# Altium project Air724UG_Reference Design_V1.0(PADS9.5).PrjPcb (part 1 of 3)
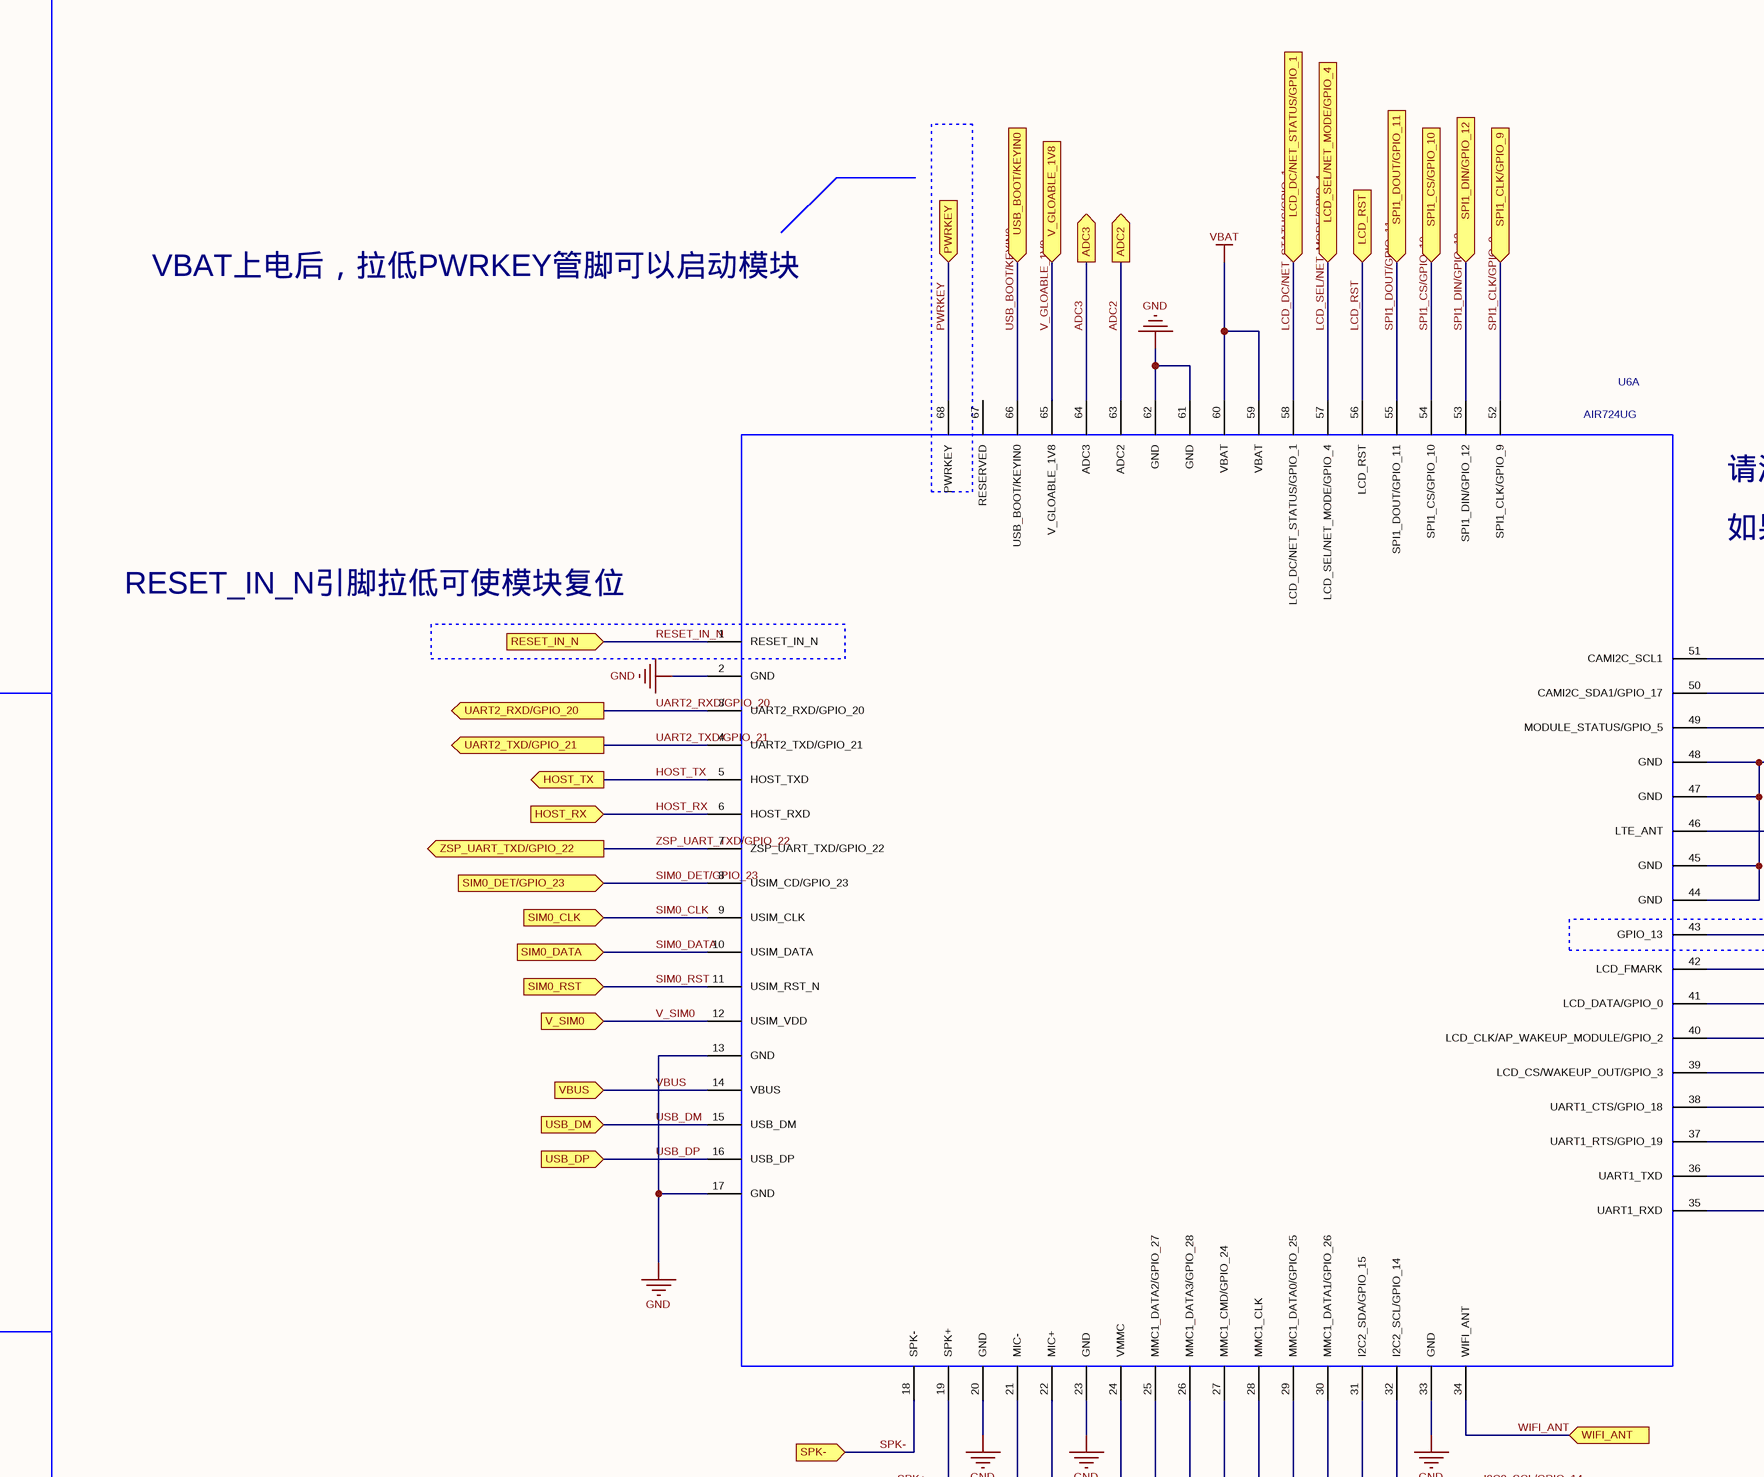
[diagram p0: MODULE.SchDoc, top left]
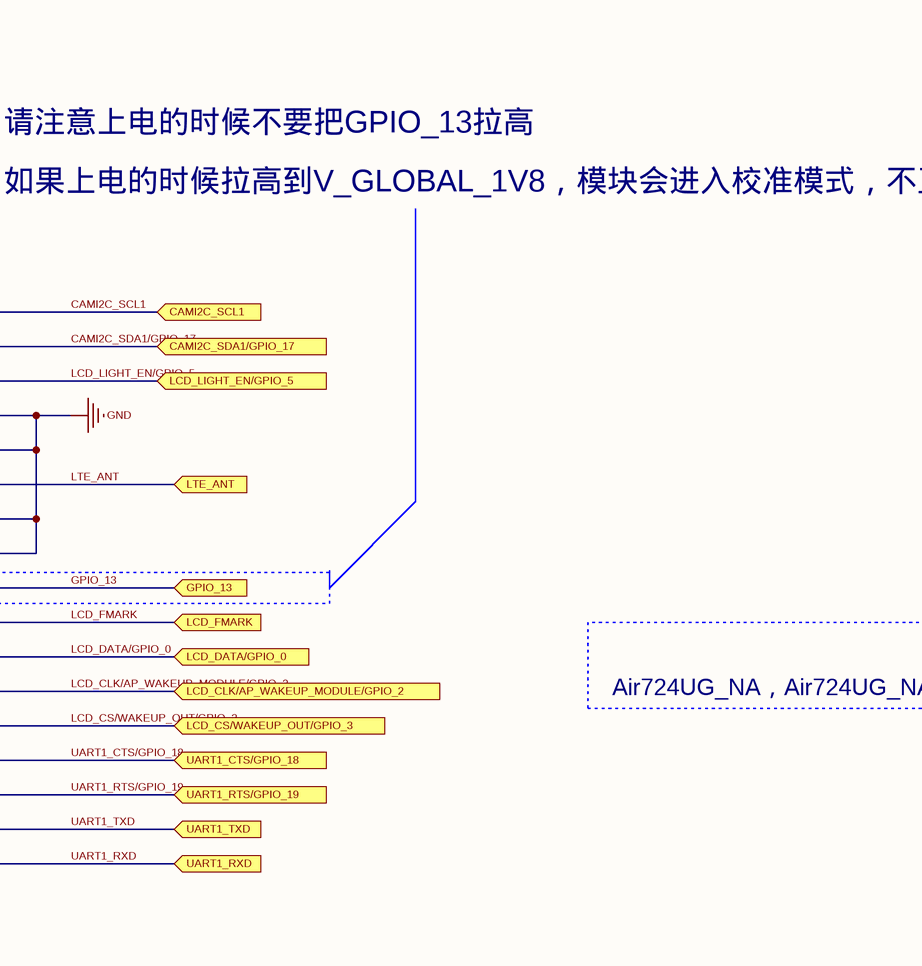
[diagram p1: MODULE.SchDoc, top middle]
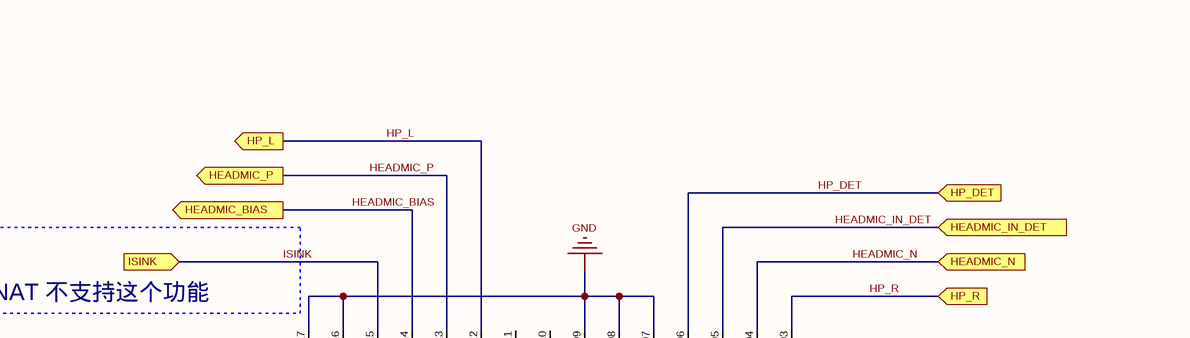
[diagram p2: MODULE.SchDoc, top right]
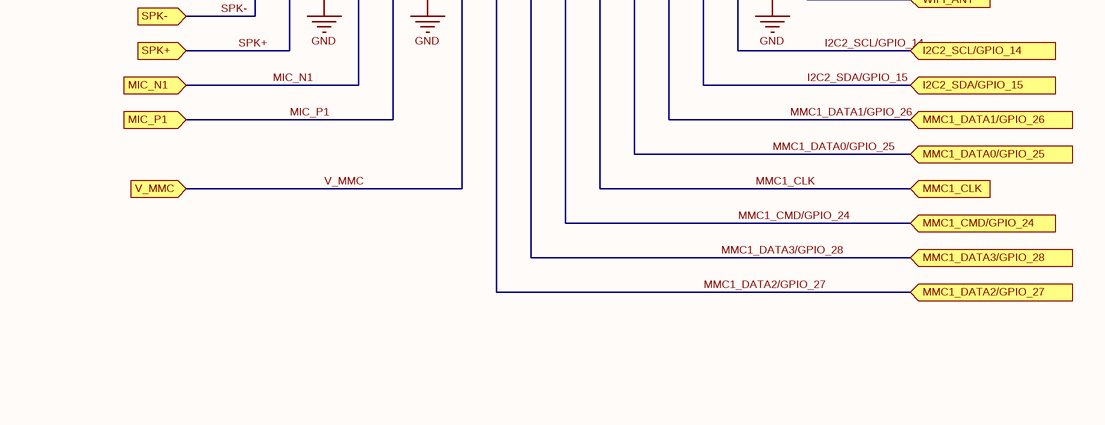
[diagram p3: MODULE.SchDoc, bottom left]
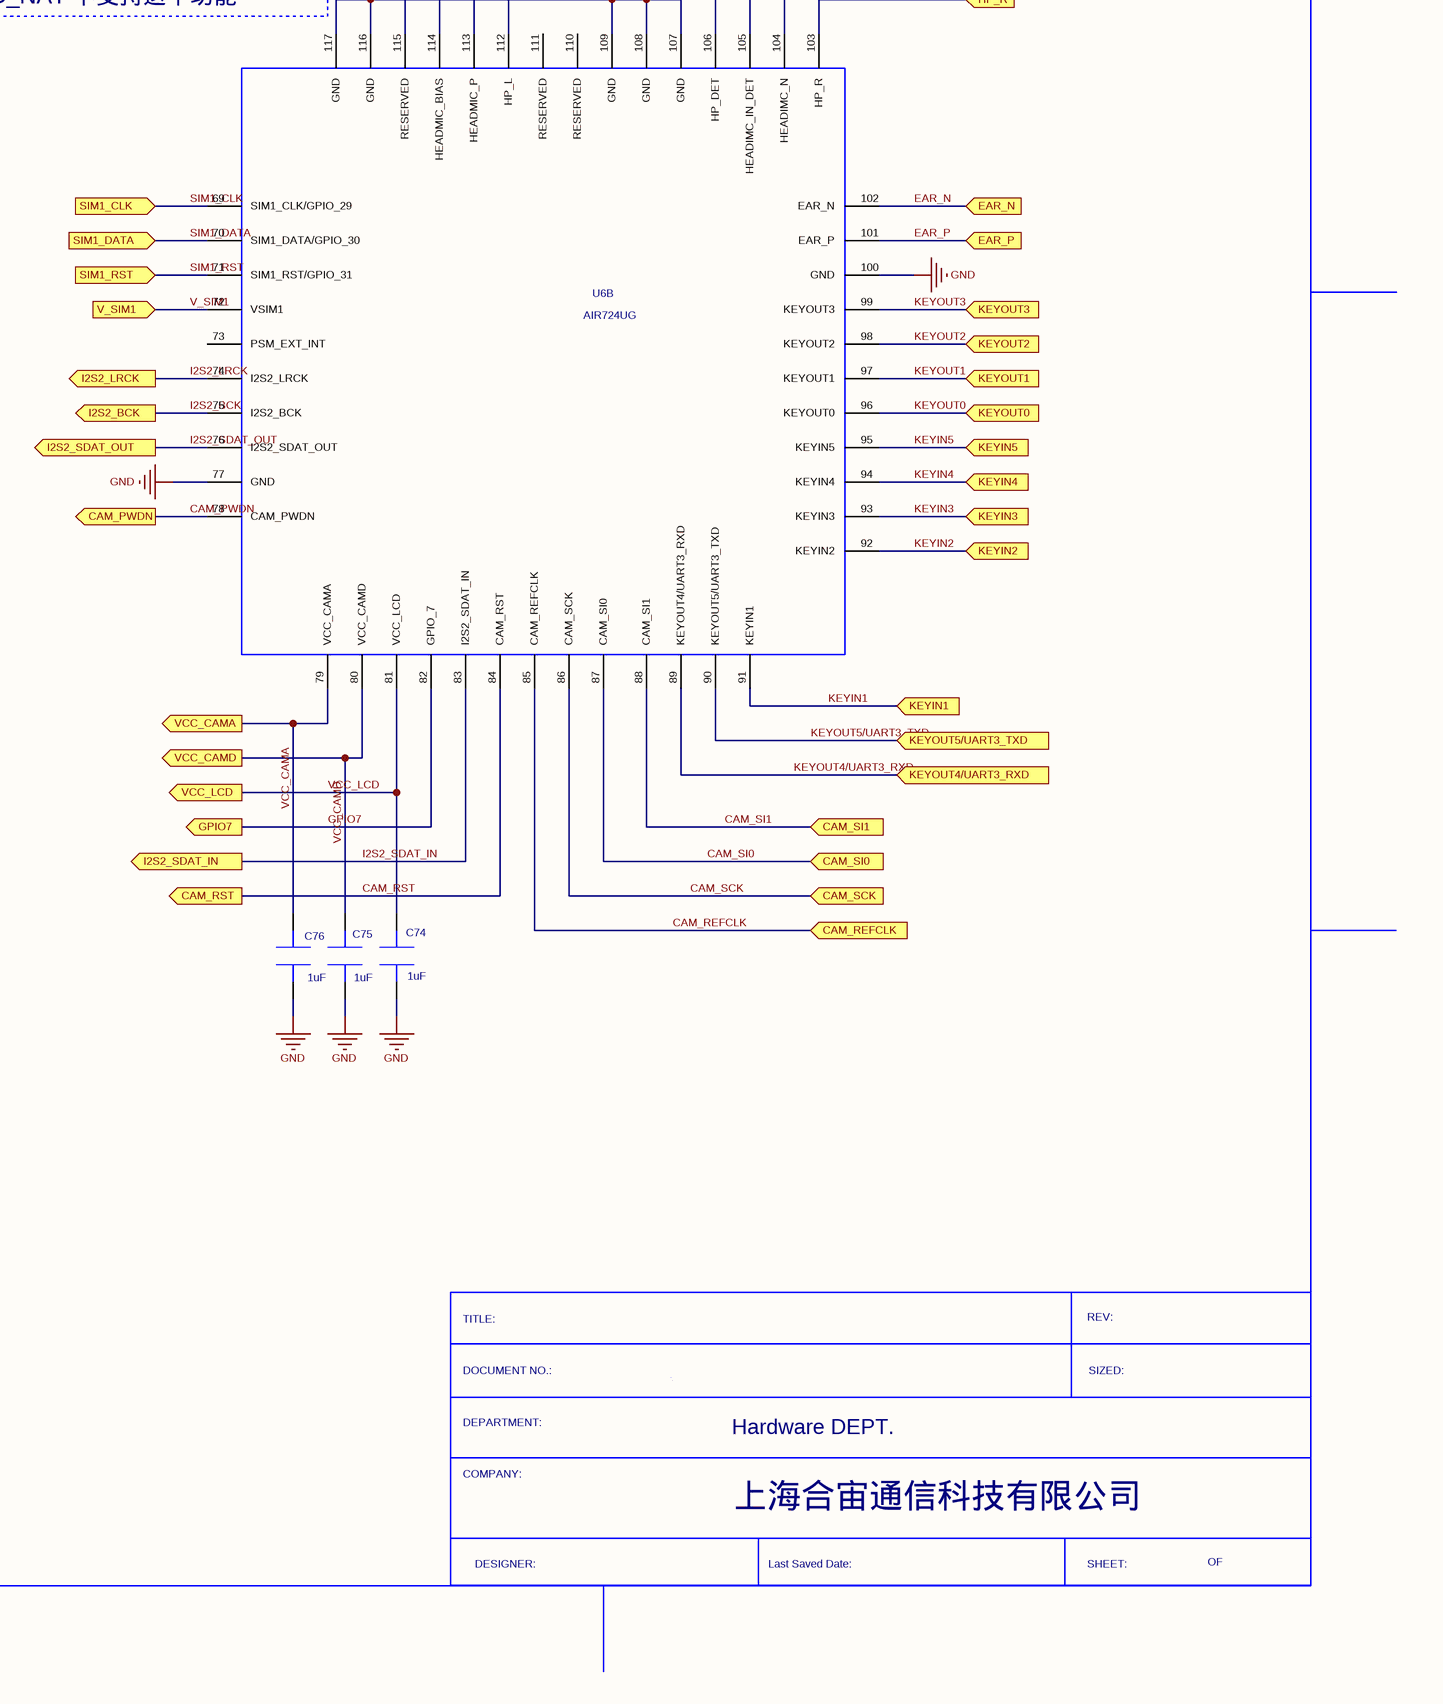
[diagram p4: MODULE.SchDoc, bottom right]
9 sheets, 186 parts. Net scope: flat (ports and power ports of the same name join across sheets).
Sheets:
  MODULE.SchDoc
  POWER.SchDoc
  ADC_RESET.SchDoc
  AUDIO_1.SchDoc
  SIM.SchDoc
  T-FLASH.SchDoc
  CAMERA.SchDoc
  UART.SchDoc
  USB.SchDoc

## Sheet MODULE.SchDoc: Air724UG 参考设计
size 594 x 419 mm; DESIGNER: Loukanghua; REV: V1.0

### Parts
C74  value 1uF  [SC0402]  (hidden comment: CAP-1UF-0402-X5R)
C75  value 1uF  [SC0402]  (hidden comment: CAP-1UF-0402-X5R)
C76  value 1uF  [SC0402]  (hidden comment: CAP-1UF-0402-X5R)
U6  AIR724UG  [AIR724UG]  (parts A,B of 2)

### Ports
ADC2 (out), ADC3 (out), CAM_PWDN (out), CAM_REFCLK (in), CAM_RST (out), CAM_SCK (in), CAM_SI0 (in), CAM_SI1 (in), CAMI2C_SCL1, CAMI2C_SDA1/GPIO_17, EAR_N (in), EAR_P (in), GPIO7 (out), GPIO_13 (in), HEADMIC_BIAS (out), HEADMIC_IN_DET, HEADMIC_N, HEADMIC_P (out), HOST_RX, HOST_TX (out), HP_DET (in), HP_L (out), HP_R (in), I2C2_SCL/GPIO_14, I2C2_SDA/GPIO_15, I2S2_BCK (out), I2S2_LRCK (out), I2S2_SDAT_IN (out), I2S2_SDAT_OUT (out), ISINK, KEYIN1 (in), KEYIN2 (in), KEYIN3 (in), KEYIN4 (in), KEYIN5 (in), KEYOUT0 (in), KEYOUT1 (in), KEYOUT2 (in), KEYOUT3 (in), KEYOUT4/UART3_RXD (in), KEYOUT5/UART3_TXD (in), LCD_CLK/AP_WAKEUP_MODULE/GPIO_2 (in), LCD_CS/WAKEUP_OUT/GPIO_3 (in), LCD_DATA/GPIO_0 (in), LCD_DC/NET_STATUS/GPIO_1 (in), LCD_FMARK (in), LCD_LIGHT_EN/GPIO_5, LCD_RST (in), LCD_SEL/NET_MODE/GPIO_4 (in), LTE_ANT, MIC_N1, MIC_P1, MMC1_CLK, MMC1_CMD/GPIO_24, MMC1_DATA0/GPIO_25, MMC1_DATA1/GPIO_26, MMC1_DATA2/GPIO_27, MMC1_DATA3/GPIO_28, PWRKEY, RESET_IN_N, SIM0_CLK, SIM0_DATA, SIM0_DET/GPIO_23, SIM0_RST, SIM1_CLK, SIM1_DATA, SIM1_RST, SPI1_CLK/GPIO_9 (in), SPI1_CS/GPIO_10 (in), SPI1_DIN/GPIO_12 (in), SPI1_DOUT/GPIO_11 (in), SPK+, SPK-, UART1_CTS/GPIO_18, UART1_RTS/GPIO_19 (in), UART1_RXD, UART1_TXD (in), UART2_RXD/GPIO_20 (out), UART2_TXD/GPIO_21 (out), USB_BOOT/KEYIN0, USB_DM, USB_DP, V_GLOABLE_1V8, V_MMC, V_SIM0, V_SIM1, VBUS, VCC_CAMA (out), VCC_CAMD (out), VCC_LCD (out), WIFI_ANT, ZSP_UART_TXD/GPIO_22 (out)

### Nets
GND: C74.1 C75.1 C76.1 U6.2(GND) U6.13(GND) U6.17(GND) U6.20(GND) U6.23(GND) U6.33(GND) U6.44(GND) U6.45(GND) U6.47(GND) U6.48(GND) U6.61(GND) U6.62(GND) U6.77(GND) U6.100(GND) U6.107(GND) U6.108(GND) U6.109(GND) U6.116(GND) U6.117(GND)
VBAT: U6.59(VBAT) U6.60(VBAT)
ADC2: U6.63(ADC2) ; port ADC2
ADC3: U6.64(ADC3) ; port ADC3
CAM_PWDN: U6.78(CAM_PWDN) ; port CAM_PWDN
CAM_REFCLK: U6.85(CAM_REFCLK) ; port CAM_REFCLK
CAM_RST: U6.84(CAM_RST) ; port CAM_RST
CAM_SCK: U6.86(CAM_SCK) ; port CAM_SCK
CAM_SI0: U6.87(CAM_SI0) ; port CAM_SI0
CAM_SI1: U6.88(CAM_SI1) ; port CAM_SI1
CAMI2C_SCL1: U6.51(CAMI2C_SCL1) ; port CAMI2C_SCL1
CAMI2C_SDA1/GPIO_17: U6.50(CAMI2C_SDA1/GPIO_17) ; port CAMI2C_SDA1/GPIO_17
EAR_N: U6.102(EAR_N) ; port EAR_N
EAR_P: U6.101(EAR_P) ; port EAR_P
GPIO7: U6.82(GPIO_7) ; port GPIO7
GPIO_13: U6.43(GPIO_13) ; port GPIO_13
HEADMIC_BIAS: U6.114(HEADMIC_BIAS) ; port HEADMIC_BIAS
HEADMIC_IN_DET: U6.105(HEADIMC_IN_DET) ; port HEADMIC_IN_DET
HEADMIC_N: U6.104(HEADIMC_N) ; port HEADMIC_N
HEADMIC_P: U6.113(HEADMIC_P) ; port HEADMIC_P
HOST_RX: U6.6(HOST_RXD) ; port HOST_RX
HOST_TX: U6.5(HOST_TXD) ; port HOST_TX
HP_DET: U6.106(HP_DET) ; port HP_DET
HP_L: U6.112(HP_L) ; port HP_L
HP_R: U6.103(HP_R) ; port HP_R
I2C2_SCL/GPIO_14: U6.32(I2C2_SCL/GPIO_14) ; port I2C2_SCL/GPIO_14
I2C2_SDA/GPIO_15: U6.31(I2C2_SDA/GPIO_15) ; port I2C2_SDA/GPIO_15
I2S2_BCK: U6.75(I2S2_BCK) ; port I2S2_BCK
I2S2_LRCK: U6.74(I2S2_LRCK) ; port I2S2_LRCK
I2S2_SDAT_IN: U6.83(I2S2_SDAT_IN) ; port I2S2_SDAT_IN
I2S2_SDAT_OUT: U6.76(I2S2_SDAT_OUT) ; port I2S2_SDAT_OUT
ISINK: U6.115(RESERVED) ; port ISINK
KEYIN1: U6.91(KEYIN1) ; port KEYIN1
KEYIN2: U6.92(KEYIN2) ; port KEYIN2
KEYIN3: U6.93(KEYIN3) ; port KEYIN3
KEYIN4: U6.94(KEYIN4) ; port KEYIN4
KEYIN5: U6.95(KEYIN5) ; port KEYIN5
KEYOUT0: U6.96(KEYOUT0) ; port KEYOUT0
KEYOUT1: U6.97(KEYOUT1) ; port KEYOUT1
KEYOUT2: U6.98(KEYOUT2) ; port KEYOUT2
KEYOUT3: U6.99(KEYOUT3) ; port KEYOUT3
KEYOUT4/UART3_RXD: U6.89(KEYOUT4/UART3_RXD) ; port KEYOUT4/UART3_RXD
KEYOUT5/UART3_TXD: U6.90(KEYOUT5/UART3_TXD) ; port KEYOUT5/UART3_TXD
LCD_CLK/AP_WAKEUP_MODULE/GPIO_2: U6.40(LCD_CLK/AP_WAKEUP_MODULE/GPIO_2) ; port LCD_CLK/AP_WAKEUP_MODULE/GPIO_2
LCD_CS/WAKEUP_OUT/GPIO_3: U6.39(LCD_CS/WAKEUP_OUT/GPIO_3) ; port LCD_CS/WAKEUP_OUT/GPIO_3
LCD_DATA/GPIO_0: U6.41(LCD_DATA/GPIO_0) ; port LCD_DATA/GPIO_0
LCD_DC/NET_STATUS/GPIO_1: U6.58(LCD_DC/NET_STATUS/GPIO_1) ; port LCD_DC/NET_STATUS/GPIO_1
LCD_FMARK: U6.42(LCD_FMARK) ; port LCD_FMARK
LCD_LIGHT_EN/GPIO_5: U6.49(MODULE_STATUS/GPIO_5) ; port LCD_LIGHT_EN/GPIO_5
LCD_RST: U6.56(LCD_RST) ; port LCD_RST
LCD_SEL/NET_MODE/GPIO_4: U6.57(LCD_SEL/NET_MODE/GPIO_4) ; port LCD_SEL/NET_MODE/GPIO_4
LTE_ANT: U6.46(LTE_ANT) ; port LTE_ANT
MIC_N1: U6.21(MIC-) ; port MIC_N1
MIC_P1: U6.22(MIC+) ; port MIC_P1
MMC1_CLK: U6.28(MMC1_CLK) ; port MMC1_CLK
MMC1_CMD/GPIO_24: U6.27(MMC1_CMD/GPIO_24) ; port MMC1_CMD/GPIO_24
MMC1_DATA0/GPIO_25: U6.29(MMC1_DATA0/GPIO_25) ; port MMC1_DATA0/GPIO_25
MMC1_DATA1/GPIO_26: U6.30(MMC1_DATA1/GPIO_26) ; port MMC1_DATA1/GPIO_26
MMC1_DATA2/GPIO_27: U6.25(MMC1_DATA2/GPIO_27) ; port MMC1_DATA2/GPIO_27
MMC1_DATA3/GPIO_28: U6.26(MMC1_DATA3/GPIO_28) ; port MMC1_DATA3/GPIO_28
PWRKEY: U6.68(PWRKEY) ; port PWRKEY
RESET_IN_N: U6.1(RESET_IN_N) ; port RESET_IN_N
SIM0_CLK: U6.9(USIM_CLK) ; port SIM0_CLK
SIM0_DATA: U6.10(USIM_DATA) ; port SIM0_DATA
SIM0_DET/GPIO_23: U6.8(USIM_CD/GPIO_23) ; port SIM0_DET/GPIO_23
SIM0_RST: U6.11(USIM_RST_N) ; port SIM0_RST
SIM1_CLK: U6.69(SIM1_CLK/GPIO_29) ; port SIM1_CLK
SIM1_DATA: U6.70(SIM1_DATA/GPIO_30) ; port SIM1_DATA
SIM1_RST: U6.71(SIM1_RST/GPIO_31) ; port SIM1_RST
SPI1_CLK/GPIO_9: U6.52(SPI1_CLK/GPIO_9) ; port SPI1_CLK/GPIO_9
SPI1_CS/GPIO_10: U6.54(SPI1_CS/GPIO_10) ; port SPI1_CS/GPIO_10
SPI1_DIN/GPIO_12: U6.53(SPI1_DIN/GPIO_12) ; port SPI1_DIN/GPIO_12
SPI1_DOUT/GPIO_11: U6.55(SPI1_DOUT/GPIO_11) ; port SPI1_DOUT/GPIO_11
SPK+: U6.19(SPK+) ; port SPK+
SPK-: U6.18(SPK-) ; port SPK-
UART1_CTS/GPIO_18: U6.38(UART1_CTS/GPIO_18) ; port UART1_CTS/GPIO_18
UART1_RTS/GPIO_19: U6.37(UART1_RTS/GPIO_19) ; port UART1_RTS/GPIO_19
UART1_RXD: U6.35(UART1_RXD) ; port UART1_RXD
UART1_TXD: U6.36(UART1_TXD) ; port UART1_TXD
UART2_RXD/GPIO_20: U6.3(UART2_RXD/GPIO_20) ; port UART2_RXD/GPIO_20
UART2_TXD/GPIO_21: U6.4(UART2_TXD/GPIO_21) ; port UART2_TXD/GPIO_21
USB_BOOT/KEYIN0: U6.66(USB_BOOT/KEYIN0) ; port USB_BOOT/KEYIN0
USB_DM: U6.15(USB_DM) ; port USB_DM
USB_DP: U6.16(USB_DP) ; port USB_DP
V_GLOABLE_1V8: U6.65(V_GLOABLE_1V8) ; port V_GLOABLE_1V8
V_MMC: U6.24(VMMC) ; port V_MMC
V_SIM0: U6.12(USIM_VDD) ; port V_SIM0
V_SIM1: U6.72(VSIM1) ; port V_SIM1
VBUS: U6.14(VBUS) ; port VBUS
VCC_CAMA: C76.2 U6.79(VCC_CAMA) ; port VCC_CAMA
VCC_CAMD: C75.2 U6.80(VCC_CAMD) ; port VCC_CAMD
VCC_LCD: C74.2 U6.81(VCC_LCD) ; port VCC_LCD
WIFI_ANT: U6.34(WIFI_ANT) ; port WIFI_ANT
ZSP_UART_TXD/GPIO_22: U6.7(ZSP_UART_TXD/GPIO_22) ; port ZSP_UART_TXD/GPIO_22

Not connected (* = marked no-connect by the designer): U6 67(RESERVED) 73(PSM_EXT_INT) 110(RESERVED) 111(RESERVED)

### Notes on the sheet
- VBAT上电后，拉低PWRKEY管脚可以启动模块
- (near U6) 请注意上电的时候不要把GPIO_13拉高
- (near U6) 如果上电的时候拉高到V_GLOBAL_1V8，模块会进入校准模式，不正常开机
- RESET_IN_N引脚拉低可使模块复位
- Air724UG_NA，Air724UG_NAT 不支持这个功能
- TITLE:
- REV:
- DEPARTMENT:
- DOCUMENT NO.:
- Hardware DEPT.
- SIZED:
- COMPANY:
- 上海合宙通信科技有限公司
- DESIGNER:
- Last Saved Date:
- SHEET:
- OF

### Library data of the parts
C74-C76 = CAP-1UF-0402-X5R: CAP CER X5R;1uF;+/-10%;6.3V;0402;0.5mm;ROHS; Manufacture 1 P/N: GRM155R60J105K****;CC0402KRX5R5BB105;C1005X5R0J105KT;JMK105BJ105KV-F;ECJ0EB0J105K;0402X105K6R3CT;CL05A105KQ5NNNC; Manufacture 1: Murata;Yageo;TDK;Taiyo Yuden;Panasonic;Walsin;Samsung; Serial Number: 80214710001; Geometry.Height: 0.55mm; Tolerance: +/-10%; PCB DECAL: SC0402
U6 = AIR724UG: Manufacture 1: AirM2M; Geometry.Height: 2.3mm; Manufacture 1 P/N: Air724UG; Description: Air724UG; PCB DECAL: AIR724UG

## Sheet POWER.SchDoc: Air724UG 参考设计
size 594 x 419 mm; DESIGNER: Loukanghua; REV: V1.0
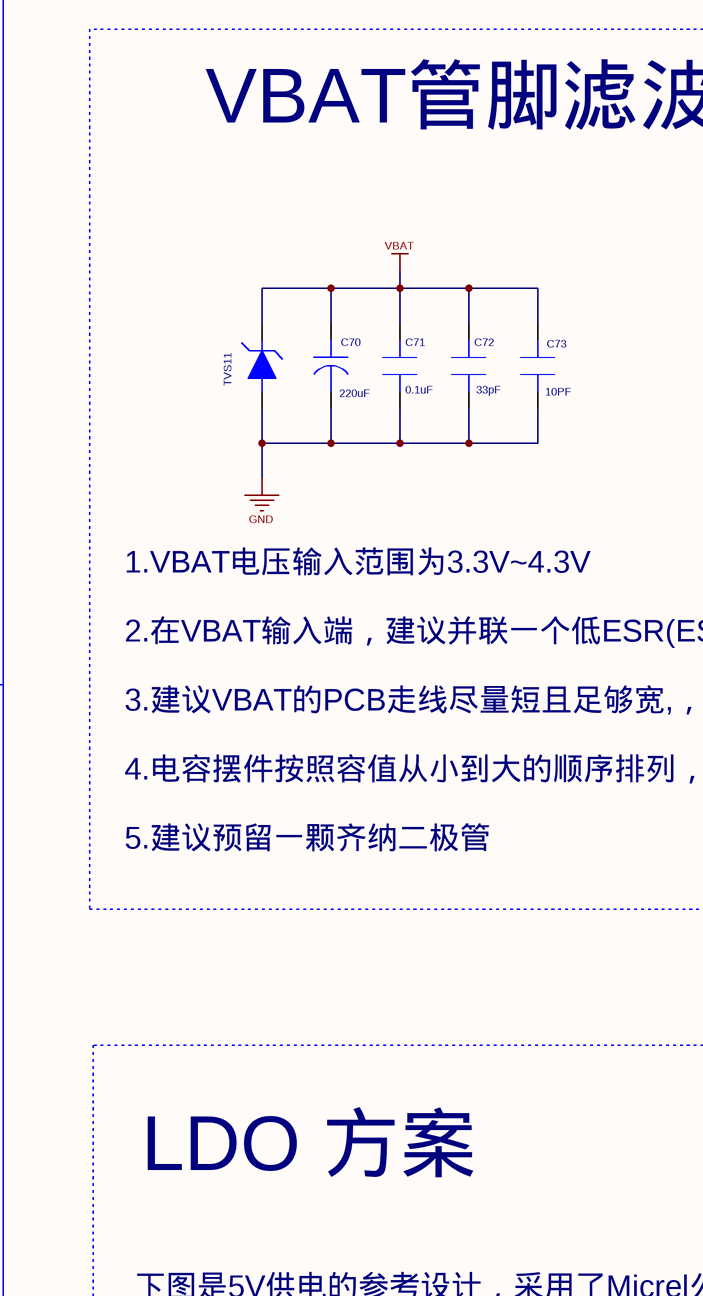
[diagram p5: POWER.SchDoc, top left]
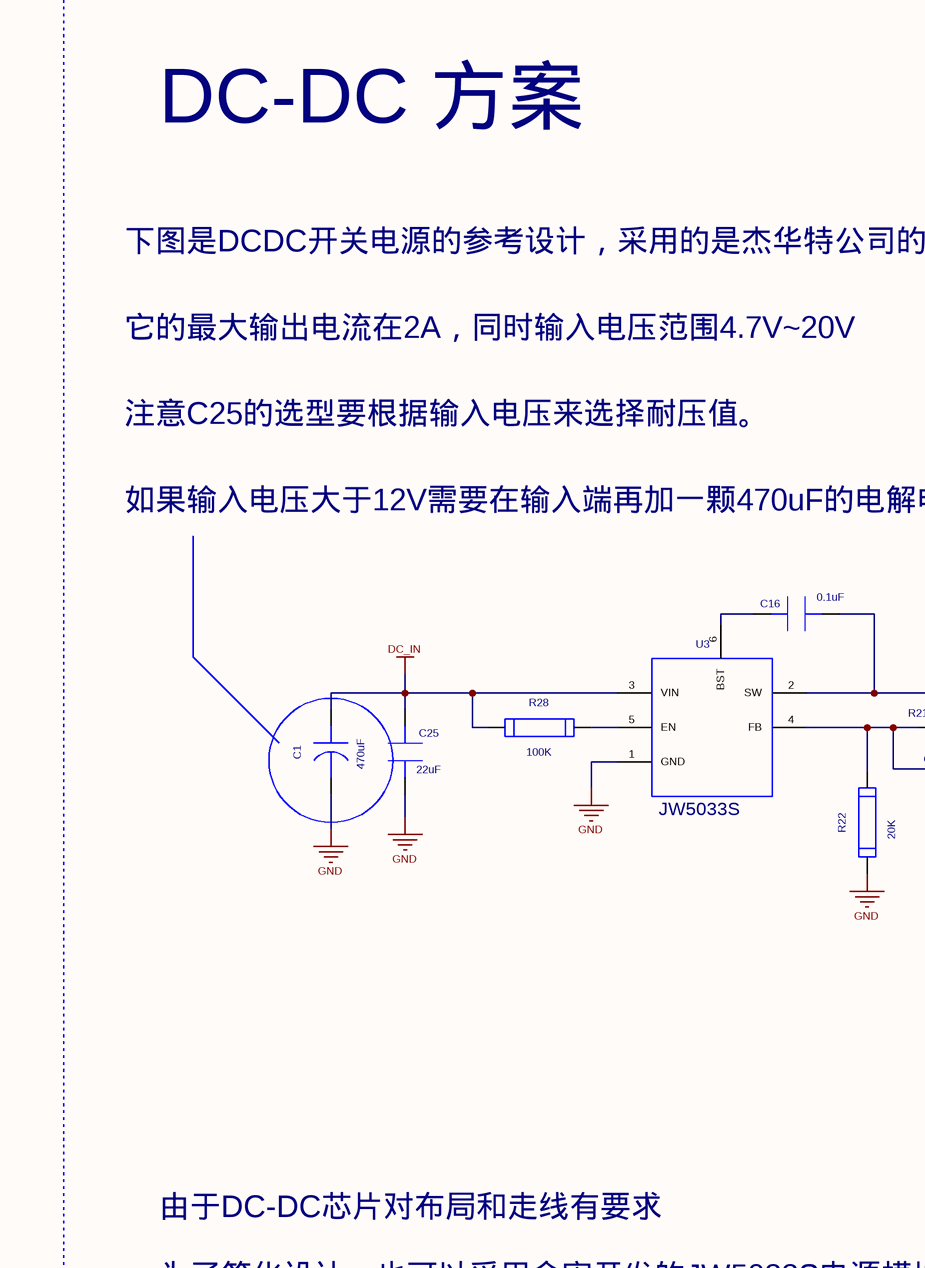
[diagram p6: POWER.SchDoc, top middle]
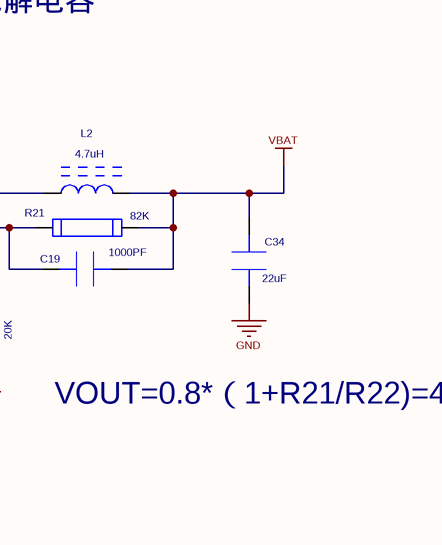
[diagram p7: POWER.SchDoc, top right]
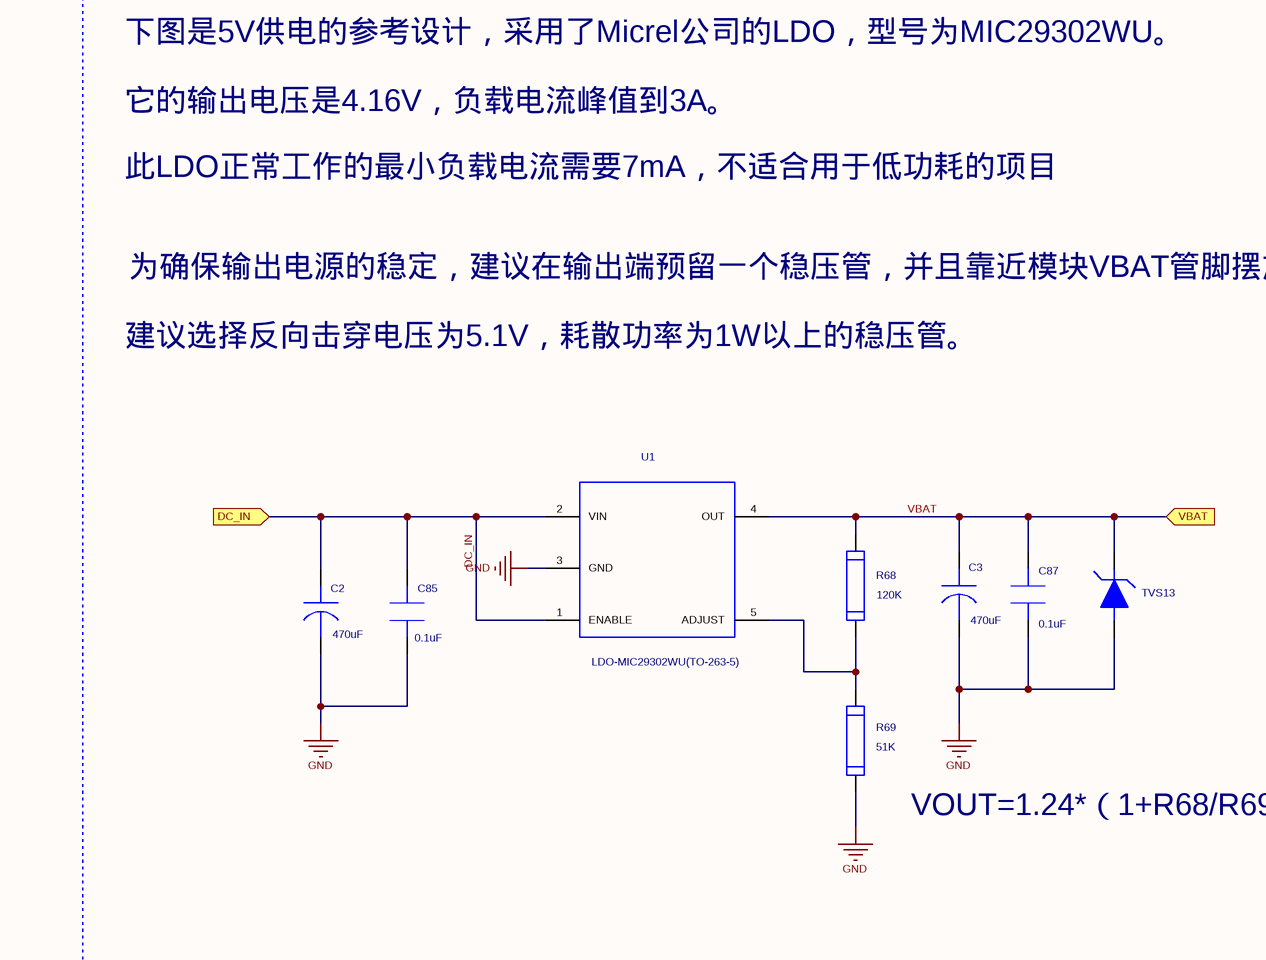
[diagram p8: POWER.SchDoc, bottom left]
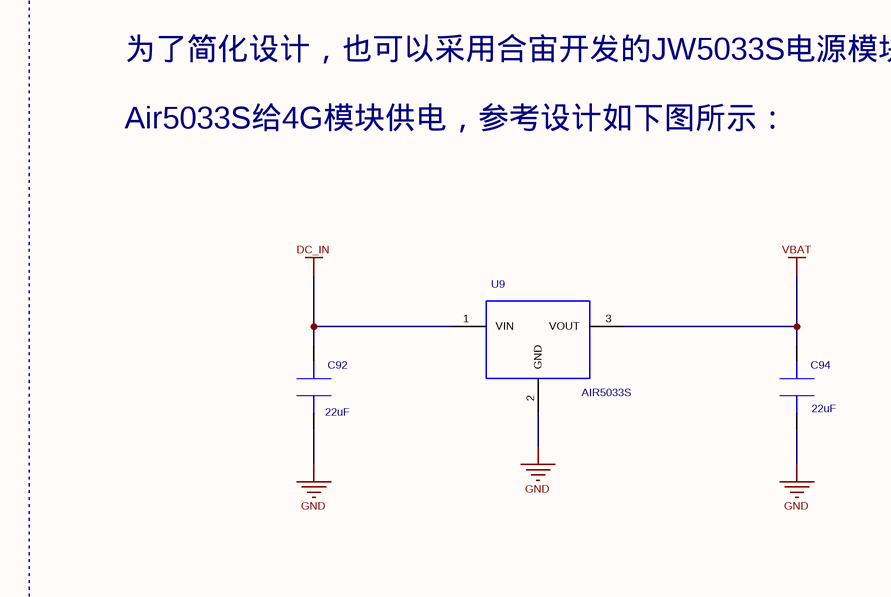
[diagram p9: POWER.SchDoc, bottom middle]
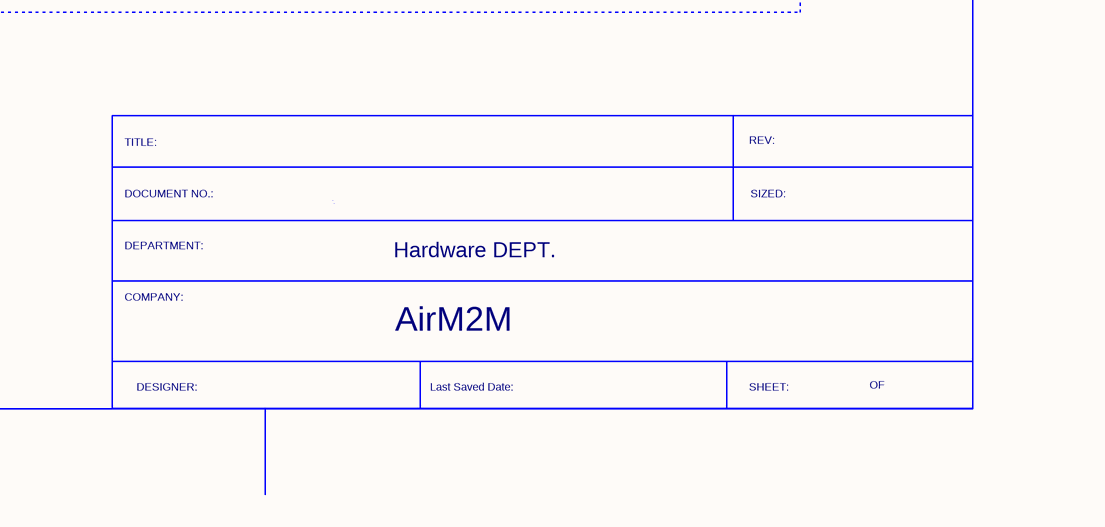
[diagram p10: POWER.SchDoc, bottom right]

### Parts
C1  value 470uF  [CAP-PD-8MMX11.5MM-UVR1C471MPD]  (hidden comment: CAP-AL-470UF-16V-8X11.5MM)
C2  value 470uF  [CAP-PD-8MMX11.5MM-UVR1C471MPD]  (hidden comment: CAP-AL-470UF-16V-8X11.5MM)
C3  value 470uF  [CAP-PD-8MMX11.5MM-UVR1C471MPD]  (hidden comment: CAP-AL-470UF-16V-8X11.5MM)
C16  value 0.1uF  [SC0402]  (hidden comment: CAP-0.1UF-0402-X5R-10V)
C19  value 1000PF  [SC0402]  (hidden comment: CAP-1000PF-0402-X7R)
C25  value 22uF  [SC0603]  (hidden comment: CAP-22UF-0603-X5R)
C34  value 22uF  [SC0603]  (hidden comment: CAP-4.7UF-0603-X5R)
C70  value 220uF  [CASEB]  (hidden comment: CAP-TAN-100UF-CASEB)
C71  value 0.1uF  [SC0402]  (hidden comment: CAP-0.1UF-0402-X7R)
C72  value 33pF  [SC0402]  (hidden comment: CAP-33PF-0402-C0G)
C73  value 10PF  [SC0402]  (hidden comment: CAP-10PF-0402-C0G)
C85  value 0.1uF  [SC0402]  (hidden comment: CAP-0.1UF-0402-X7R)
C87  value 0.1uF  [SC0402]  (hidden comment: CAP-0.1UF-0402-X7R)
C92  value 22uF  [SC0805]  (hidden comment: CAP-22UF-0805-X5R)
C94  value 22uF  [SC0805]  (hidden comment: CAP-22UF-0805-X5R)
L2  value 4.7uH  [MRSC252A12-4R7W-N]  (hidden comment: MRSC252A12-4R7W-N)
R21  value 82K  [SR0402]  (hidden comment: RES-82K-+-1%-0402)
R22  value 20K  [SR0402]  (hidden comment: RES-20K-+/-1%-0402)
R28  value 100K  [SR0402]  (hidden comment: RES-100K-0402)
R68  value 120K  [SR0402]  (hidden comment: RES-120K-+-1%-0402)
R69  value 51K  [SR0402]  (hidden comment: RES-51K-0402)
TVS11  ESD-TVS-PESDU4581P1H  [DFN1006]  (value not drawn)
TVS13  ESD-TVS-PESDU4581P1H  [DFN1006]  (value not drawn)
U1  LDO-MIC29302WU(TO-263-5)  [TO-263-5L]
U3  JW5033H  [JW5033S]  (value not drawn)
U9  AIR5033S  [A5033S]

### Blocks framed on the sheet
VBAT管脚滤波电容: C70-C73 TVS11
DC-DC 方案: C1 C16 C19 C25 C34 C92 C94 L2 R21 R22 R28 U3 U9
LDO 方案: C2 C3 C85 C87 R68 R69 TVS13 U1

### Ports
DC_IN, VBAT

### Nets
DC_IN: C1.1 C2.1 C25.2 C85.1 C92.2 R28.1 U1.1(ENABLE) U1.2(VIN) U3.3(VIN) U9.1(VIN) ; port DC_IN
GND: C1.2 C2.2 C3.2 C25.1 C34.1 C70.2 C71.2 C72.2 C73.2 C85.2 C87.2 C92.1 C94.1 R22.1 R69.1 TVS11.2 TVS13.2 U1.3(GND) U1.6(GND) U3.1(GND) U9.2(GND)
VBAT: C3.1 C19.2 C34.2 C70.1 C71.1 C72.1 C73.1 C87.1 C94.2 L2.2 R21.2 R68.2 TVS11.1 TVS13.1 U1.4(OUT) U9.3(VOUT) ; port VBAT
NetC16_1: C16.1 U3.6(BST)
NetC16_2: C16.2 L2.1 U3.2(SW)
NetC19_1: C19.1 R21.1 R22.2 U3.4(FB)
NetR28_2: R28.2 U3.5(EN)
NetR68_1: R68.1 R69.2 U1.5(ADJUST)

### Notes on the sheet
- 下图是DCDC开关电源的参考设计，采用的是杰华特公司的JW5033S 开关电源芯片
- 它的最大输出电流在2A，同时输入电压范围4.7V~20V
- 注意C25的选型要根据输入电压来选择耐压值。
- 1.VBAT电压输入范围为3.3V~4.3V
- 如果输入电压大于12V需要在输入端再加一颗470uF的电解电容
- 2.在VBAT输入端，建议并联一个低ESR(ESR=0.7Ω)的220uF的钽电容，以及100nF、33pF、10pF滤波电容
- 3.建议VBAT的PCB走线尽量短且足够宽,，宽度不少于1.2mm
- 4.电容摆件按照容值从小到大的顺序排列，所有电容都要靠近VBAT引脚放置。
- 5.建议预留一颗齐纳二极管
- (near U3) JW5033S
- VOUT=0.8*（1+R21/R22)=4.08V
- 由于DC-DC芯片对布局和走线有要求
- 下图是5V供电的参考设计，采用了Micrel公司的LDO，型号为MIC29302WU。
- 为了简化设计，也可以采用合宙开发的JW5033S电源模块：
- 它的输出电压是4.16V，负载电流峰值到3A。
- 此LDO正常工作的最小负载电流需要7mA，不适合用于低功耗的项目
- Air5033S给4G模块供电，参考设计如下图所示：
- 建议选择反向击穿电压为5.1V，耗散功率为1W以上的稳压管。
- 为确保输出电源的稳定，建议在输出端预留一个稳压管，并且靠近模块VBAT管脚摆放。
- (near R69) VOUT=1.24*（1+R68/R69)=4.16V
- TITLE:
- REV:
- DEPARTMENT:
- DOCUMENT NO.:
- Hardware DEPT.
- SIZED:
- COMPANY:
- AirM2M
- DESIGNER:
- Last Saved Date:
- SHEET:
- OF

### Library data of the parts
C1-C3 = CAP-AL-470UF-16V-8X11.5MM: 铝电解电容器;470uF;+/-20%;16V;8x11.5mm;引脚间距3.5mm;ROHS; Manufacture 1: NICHICON; Manufacture 1 P/N: UVR1C471MPD; Geometry.Height: 11.5mm; Serial Number: 80200830001; Tolerance: +/-20%; PCB DECAL: CAP-PD-8MMX11.5MM-UVR1C471MPD
C16 = CAP-0.1UF-0402-X5R-10V: CAP CER X5R/X7R;0.1uF;+/-10%;10V;0402;0.5mm;ROHS; Manufacture 1: Murata;Yageo;Walsin;Eyang; Manufacture 1 P/N: GRM155R61A104K****;GRM155R71A104K****;CC0402KRX5R6BB104;0402X104K100CT;C0402X5R104K100N*; Geometry.Height: 0.55mm; Serial Number: 80214720001; Tolerance: +/-10%; PCB DECAL: SC0402
C19 = CAP-1000PF-0402-X7R: CAP CER X7R;1000PF;+/-10%;50V;0402;0.5mm;ROHS; Manufacture 1 P/N: GRM155R71H102K****;CC0402KRX7R9BB102;0402B102K500CT;C0402X7R102K500N*; Manufacture 1: MURATA;Yageo;Walsin;Eyang; Geometry.Height: 0.55mm; Serial Number: 80214750001; Tolerance: +/-10%; PCB DECAL: SC0402
C25 = CAP-22UF-0603-X5R: CAP CER X5R;22uF;+/-20%;6.3V;0603;0.8mm;ROHS; Geometry.Height: 0.95mm; Tolerance: +/-20%; PCB DECAL: SC0603
C34 = CAP-4.7UF-0603-X5R: CAP CER X5R;4.7uF;+/-10%;6.3V;0603;0.8mm;ROHS; Manufacture 1: Murata;TDK;Yageo;Taiyo Yuden;Panasonic;Kyocera;Samsung;; Manufacture 1 P/N: GRM188R60J475K****;C1608X5R0J475K;CC0603KRX5R5BB475;JMK107BJ475KA-T;ECJ1VB0J475K;CV105X5R475K06ATCL10A475KQ8NNNC;; Geometry.Height: 0.95mm; Serial Number: 80216710002; Tolerance: +/-10%; PCB DECAL: SC0603
C70 = CAP-TAN-100UF-CASEB: CAP TAN;220uF;+/-20%;6.3V;CASEB;3.5*2.8*2.1mm;ROHS; Manufacture 1: Nichicon; Manufacture 1 P/N: F930J227MBA; Geometry.Height: 2.1mm; Serial Number: 80233810003; Tolerance: +/-20%; PCB DECAL: CASEB
C71 C85 C87 = CAP-0.1UF-0402-X7R: CAP CER X7R;0.1uF;+/-10%;16V;0402;0.5mm;ROHS; Manufacture 1: MURATA;Walsin;Yageo;Eyang;; Manufacture 1 P/N: GRM155R71C104K****;0402X104K160CT;CC0402KRX7R7BB104;C0402X5R104K160N*; Geometry.Height: 0.55mm; Serial Number: 80214730006; Tolerance: +/-10%; PCB DECAL: SC0402
C72 = CAP-33PF-0402-C0G: CAP CER C0G;33PF;+/-5%;50V;0402;0.5mm;ROHS; Manufacture 1: MURATA;Yageo;Eyang; Manufacture 1 P/N: GRM1555C1H330J****;CC0402JRNPO9BN330;C0402C0G330J500N*; Geometry.Height: 0.55mm; Serial Number: 80214650008; Tolerance: +/-5%; PCB DECAL: SC0402
C73 = CAP-10PF-0402-C0G: CAP CER C0G;10PF;+/-5%;50V;0402;0.5mm;ROHS; Manufacture 1: MURATA;TDK;Walsin;Yageo; Manufacture 1 P/N: GRM1555C1H100J****;C1005C0G1H100D;0402N100J500CT;CC0402JRNPO9BN100; Geometry.Height: 0.55mm; Serial Number: 80214650001; Tolerance: +/-5%; PCB DECAL: SC0402
C92 = CAP-22UF-0805-X5R: CAP CER X5R;22uF;20%;6.3V;0805;1.25mm;ROHS; Manufacture 1: Murata;Panasonic;TDK;Eyang;Taiyo Yuden;Samsung;Kyocera;; Manufacture 1 P/N: GRM21BR60J226M****;ECJ2FB0J226M;C2012JB0J226M;C0805X5R226M6R3NTM;JMK212BJ226MG-T;CL21A226MQQNNNE;CV21X5R226M06AT;; Geometry.Height: 1.55mm; Serial Number: 80218810001; Tolerance: 20%; PCB DECAL: SC0805
C94 = CAP-22UF-0805-X5R: CAP CER X5R;22uF;20%;6.3V;0805;1.25mm;ROHS; Manufacture 1: Murata;Panasonic;TDK;Eyang;Taiyo Yuden;Samsung;Kyocera;; Manufacture 1 P/N: GRM21BR60J226M****;ECJ2FB0J226M;C2012JB0J226M;C0805X5R226M6R3NTM;JMK212BJ226MG-T;CL21A226MQQNNNE;CV21X5R226M06AT;; Geometry.Height: 1.55mm; Serial Number: 80218810001; Priority: 1; Tolerance: 20%; PCB DECAL: SC0805; DataSheet: Z:\Datasheet\CAP\MURATA_GRM188R61A226ME15D.pdf; Update Time: 2015-12-14
L2 = MRSC252A12-4R7W-N: Manufacture 1: Chilisin(奇力新); Geometry.Height: 1.2 mm; PCB DECAL: MRSC252A12-4R7W-N
R21 = RES-82K-+-1%-0402: RES FILM;82K;+/-1%;1/16W;0402;0.4mm;ROHS; Manufacture 1: YAGEO; Manufacture 1 P/N: RC0402FR-0782KL; Serial Number: 80114440040; Geometry.Height: 0.4mm; Tolerance: +/-1%; PCB DECAL: SR0402
R22 = RES-20K-+/-1%-0402: RES FILM;20K;+/-1%;1/16W;0402;0.4mm;ROHS; Manufacture 1 P/N: RC0402FR-0720KL; Manufacture 1: YAGEO; Serial Number: 80114440008; Geometry.Height: 0.4mm; Tolerance: +/-1%; PCB DECAL: SR0402
R28 = RES-100K-0402: RES FILM;100K;+/-5%;1/16W;0402;0.4mm;ROHS; Manufacture 1: YAGEO;Walsin; Manufacture 1 P/N: RC0402JR-07100KL;WR04X104_JTL;; Geometry.Height: 0.40mm; Serial Number: 80114640005; Tolerance: +/-5%; PCB DECAL: SR0402
R68 = RES-120K-+-1%-0402: RES FILM;120K;+/-1%;1/16W;0402;0.4mm;ROHS; Manufacture 1 P/N: RC0402FR-07120KL; Manufacture 1: YAGEO; Tolerance: 1%; Serial Number: 80114440124; Geometry.Height: 0.40mm; PCB DECAL: SR0402
R69 = RES-51K-0402: RES FILM;51K;+/-5%;1/16W;0402;0.4mm;ROHS; Manufacture 1 P/N: RC0402JR-0751KL; Manufacture 1: YAGEO; Serial Number: 80114640015; Tolerance: +/-5%; Geometry.Height: 0.4mm; PCB DECAL: SR0402
TVS11 TVS13 = ESD-TVS-PESDU4581P1H: TVS；4.5V；双向；400W；DFN1006-2;1*0.6*0.5mm;ROHS; Manufacture 1: 智晶; Serial Number: 920190520185119; Geometry.Height: 0.4mm; Manufacture 1 P/N: PESDU4581P1H; PCB DECAL: DFN1006
U1 = LDO-MIC29302WU(TO-263-5): LDO;Adjustable;3A;TO-263-5;4.5mm;ROHS; Manufacturer: Micrel;; Geometry.Height: 4.7mm; Manufacture P/N: MIC29302WU; PCB DECAL: TO-263-5L
U3 = JW5033H: Geometry.Height: 1.1mm; PCB DECAL: JW5033S
U9 = AIR5033S: PCB DECAL: A5033S

## Sheet ADC_RESET.SchDoc: Air724UG 参考设计
size 594 x 419 mm; DESIGNER: Loukanghua; REV: V1.0
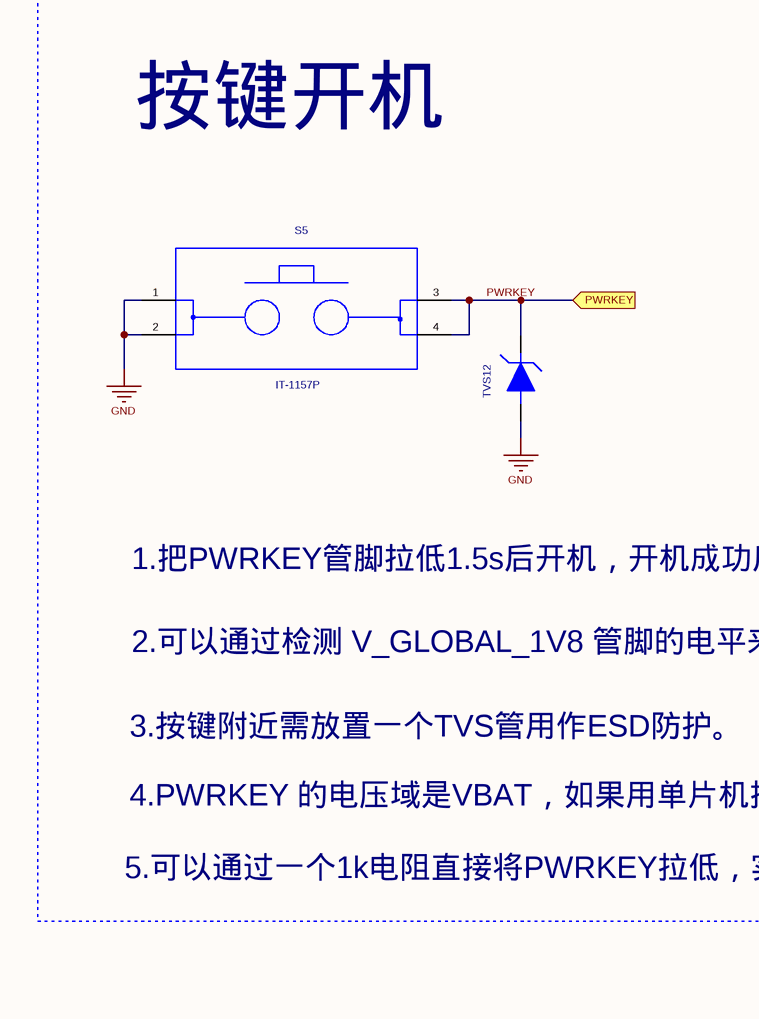
[diagram p11: ADC_RESET.SchDoc, top left]
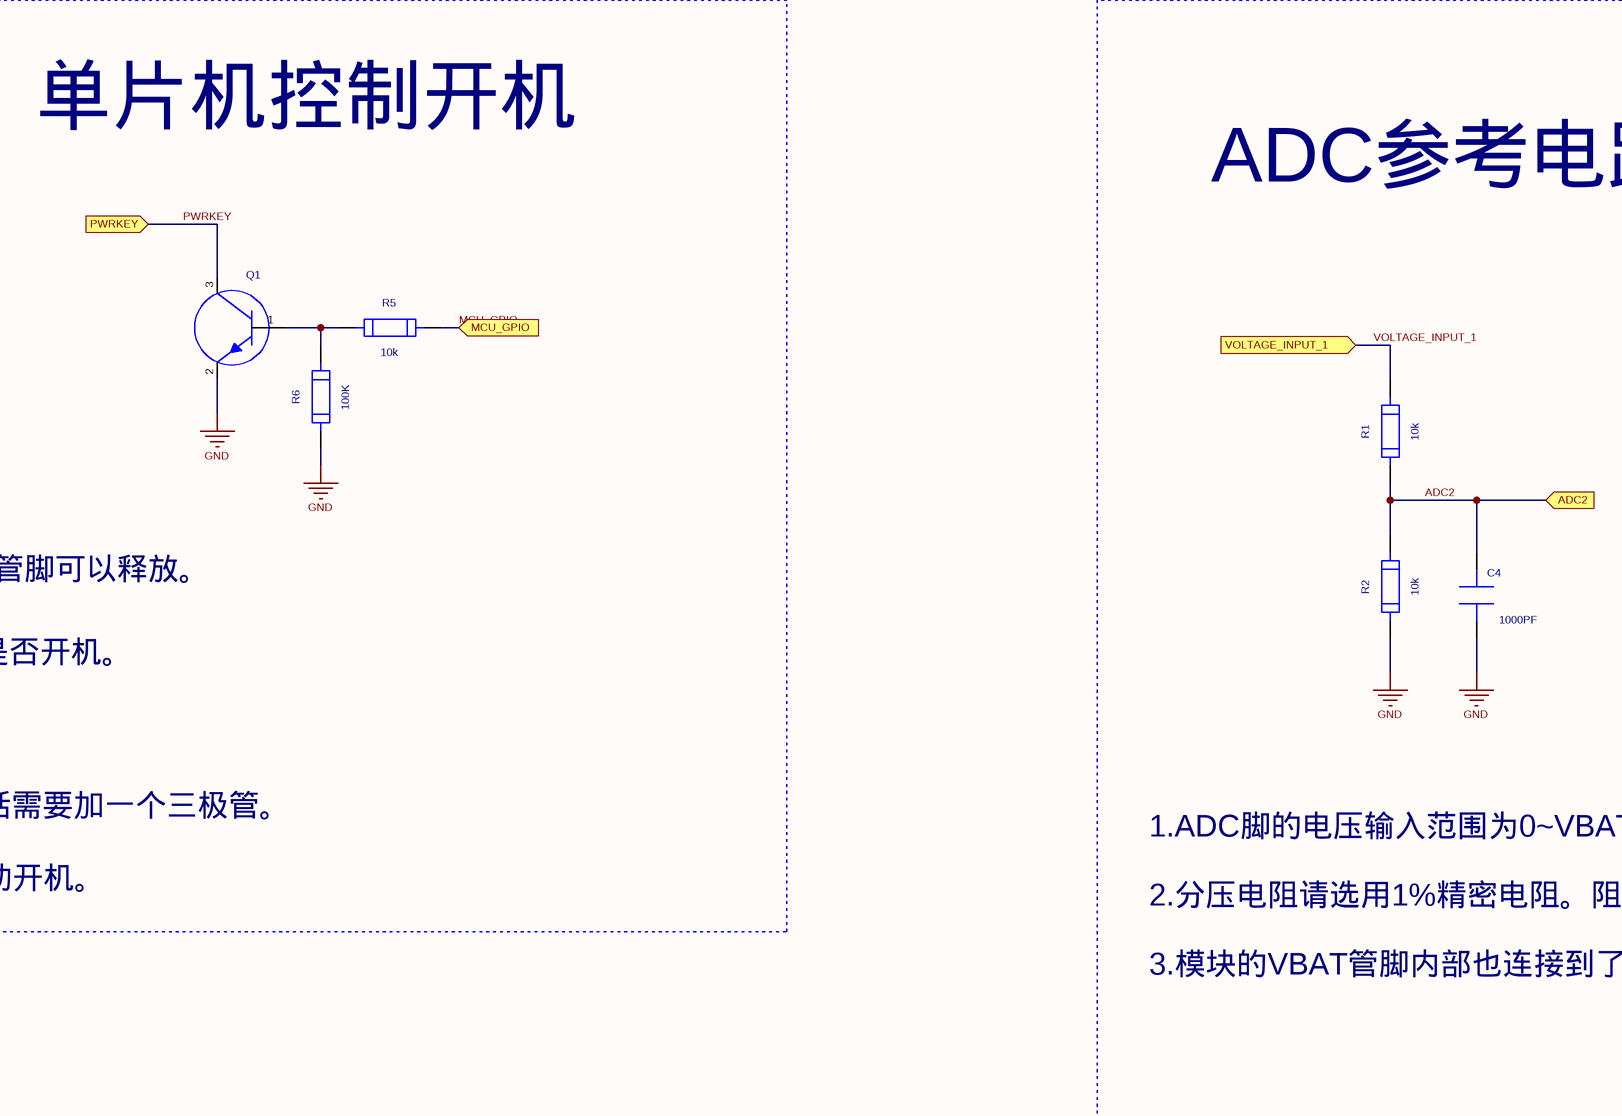
[diagram p12: ADC_RESET.SchDoc, top middle]
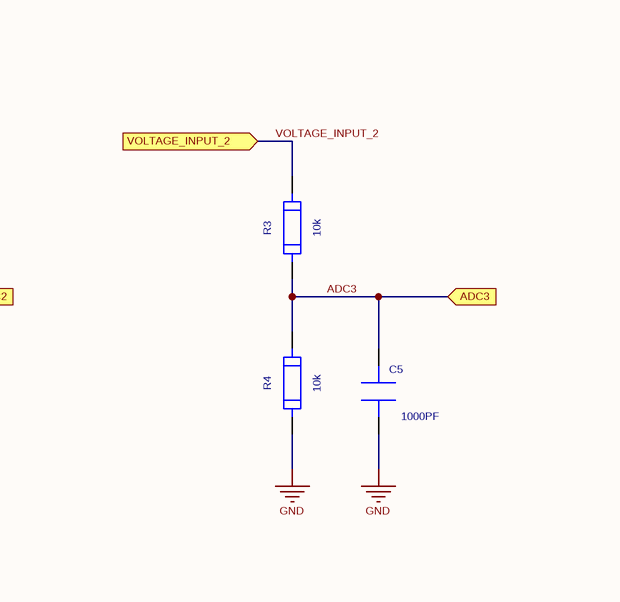
[diagram p13: ADC_RESET.SchDoc, top right]
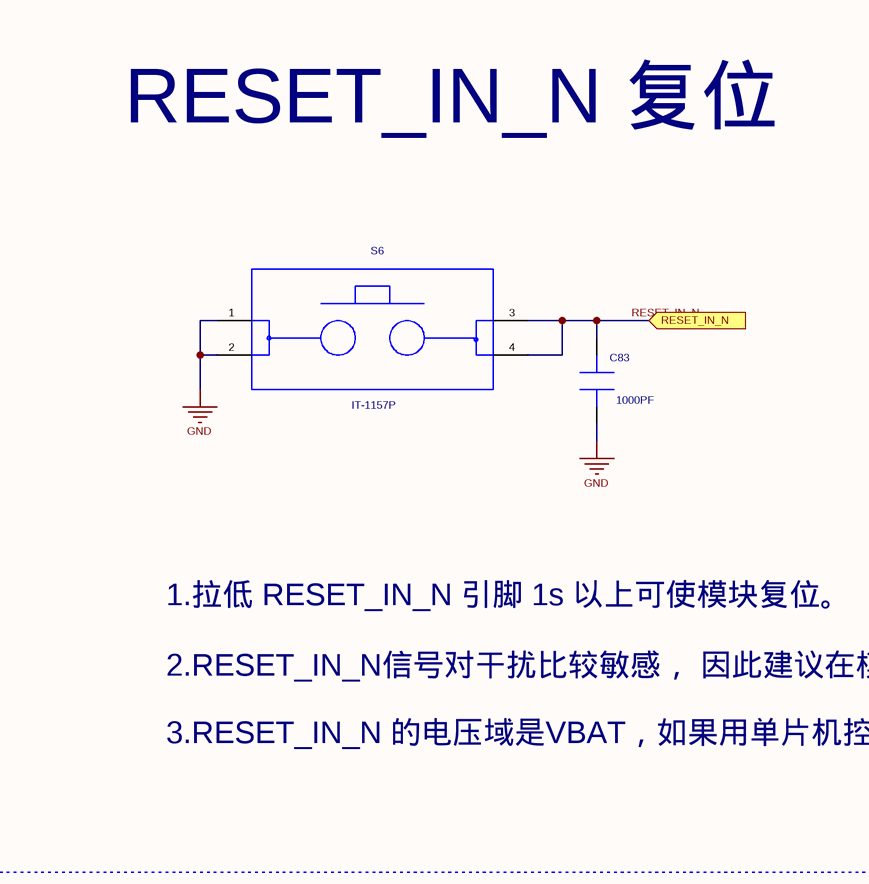
[diagram p14: ADC_RESET.SchDoc, bottom left]
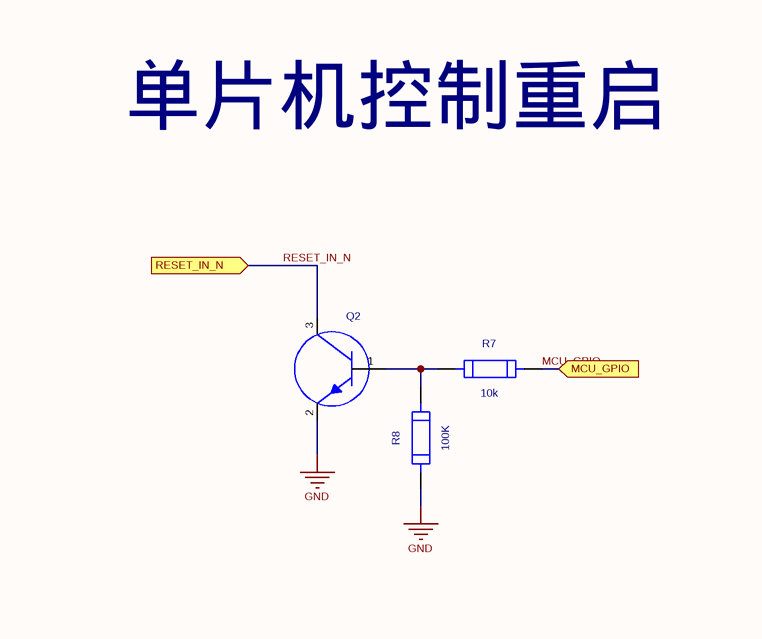
[diagram p15: ADC_RESET.SchDoc, bottom middle]
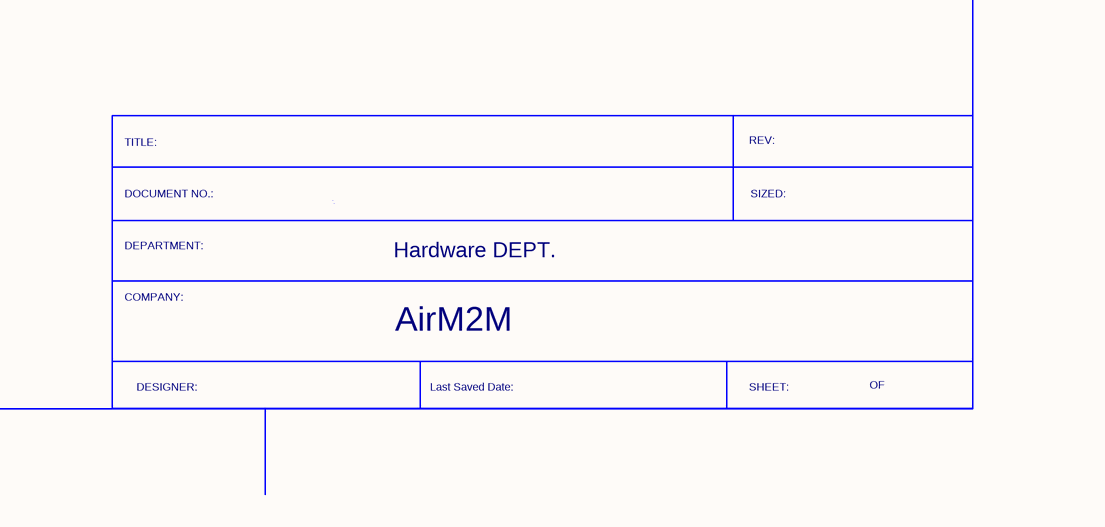
[diagram p16: ADC_RESET.SchDoc, bottom right]

### Parts
C4  value 1000PF  [SC0402]  (hidden comment: CAP-1000PF-0402-X7R)
C5  value 1000PF  [SC0402]  (hidden comment: CAP-1000PF-0402-X7R)
C83  value 1000PF  [SC0402]  (hidden comment: CAP-1000PF-0402-X7R)
Q1  TRIODE-NPN-MMBT3904  [SOT-23(MMBT3904)]  (value not drawn)
Q2  TRIODE-NPN-MMBT3904  [SOT-23(MMBT3904)]  (value not drawn)
R1  value 10k  [SR0402]  (hidden comment: RES-10K-0402)
R2  value 10k  [SR0402]  (hidden comment: RES-10K-0402)
R3  value 10k  [SR0402]  (hidden comment: RES-10K-0402)
R4  value 10k  [SR0402]  (hidden comment: RES-10K-0402)
R5  value 10k  [SR0402]  (hidden comment: RES-10K-0402)
R6  value 100K  [SR0402]  (hidden comment: RES-100K-0402)
R7  value 10k  [SR0402]  (hidden comment: RES-10K-0402)
R8  value 100K  [SR0402]  (hidden comment: RES-100K-0402)
S5  IT-1157P  [IT-1157P]
S6  IT-1157P  [IT-1157P]
TVS12  ESD-TVS-PESDU4581P1H  [DFN1006]  (value not drawn)

### Blocks framed on the sheet
ADC参考电路: C4 C5 R1-R4

### Ports
ADC2 (in), ADC3 (in), MCU_GPIO, PWRKEY, RESET_IN_N, VOLTAGE_INPUT_1, VOLTAGE_INPUT_2

### Nets
GND: C4.1 C5.1 C83.2 Q1.2 Q2.2 R2.1 R4.1 R6.1 R8.1 S5.1 S5.2 S5.5(GND) S6.1 S6.2 S6.5(GND) TVS12.2
ADC2: C4.2 R1.1 R2.2 ; port ADC2
ADC3: C5.2 R3.1 R4.2 ; port ADC3
MCU_GPIO: R5.2 R7.2 ; port MCU_GPIO
PWRKEY: Q1.3 S5.3 S5.4 TVS12.1 ; port PWRKEY
RESET_IN_N: C83.1 Q2.3 S6.3 S6.4 ; port RESET_IN_N
VOLTAGE_INPUT_1: R1.2 ; port VOLTAGE_INPUT_1
VOLTAGE_INPUT_2: R3.2 ; port VOLTAGE_INPUT_2
NetQ1_1: Q1.1 R5.1 R6.2
NetQ2_1: Q2.1 R7.1 R8.2

### Notes on the sheet
- 按键开机
- 单片机控制开机
- 1.把PWRKEY管脚拉低1.5s后开机，开机成功后PWRKEY管脚可以释放。
- 2.可以通过检测 V_GLOBAL_1V8 管脚的电平来判别模块是否开机。
- 3.按键附近需放置一个TVS管用作ESD防护。
- 5.可以通过一个1k电阻直接将PWRKEY拉低，实现上电自动开机。
- 4.PWRKEY 的电压域是VBAT，如果用单片机控制开机的话需要加一个三极管。
- 1.ADC脚的电压输入范围为0~VBAT;分辨率11bits。
- 2.分压电阻请选用1%精密电阻。阻值要高（10K级以上），减少耗流及避免灌电。
- 3.模块的VBAT管脚内部也连接到了ADC，可以读取VBAT管脚的电压。
- RESET_IN_N 复位
- 单片机控制重启
- 1.拉低 RESET_IN_N 引脚 1s 以上可使模块复位。
- 2.RESET_IN_N信号对干扰比较敏感， 因此建议在模块接口板上的走线应尽量的短，且需包地处理。
- 3.RESET_IN_N 的电压域是VBAT，如果用单片机控制重启的话需要加一个三极管。
- TITLE:
- REV:
- DEPARTMENT:
- DOCUMENT NO.:
- Hardware DEPT.
- SIZED:
- COMPANY:
- AirM2M
- DESIGNER:
- Last Saved Date:
- SHEET:
- OF

### Library data of the parts
C4 C5 = CAP-1000PF-0402-X7R: as C19 on sheet POWER; Tolerance: +/-10%; PCB DECAL: SC0402
C83 = CAP-1000PF-0402-X7R: CAP CER X7R;1000PF;+/-10%;50V;0402;0.5mm;ROHS; Manufacture 1: MURATA;Yageo;Walsin;Eyang; Manufacture 1 P/N: GRM155R71H102K****;CC0402KRX7R9BB102;0402B102K500CT;C0402X7R102K500N*; Geometry.Height: 0.55mm; Serial Number: 80214750001; Tolerance: +/-10%; PCB DECAL: SC0402
Q1 Q2 = TRIODE-NPN-MMBT3904: Transistor;NPN;40V;200mA;SOT23;1.1mm;ROHS; Manufacture 1: 长电; Serial Number: 81232000008; Geometry.Height: 1.1mm; Manufacture 1 P/N: MMBT3904; PCB DECAL: SOT-23(MMBT3904)
R1-R4 = RES-10K-0402: RES FILM;10K;+/-5%;1/16W;0402;0.4mm;ROHS; Manufacture 1: YAGEO;Walsin; Manufacture 1 P/N: RC0402JR-0710KL;WR04X103_JTL; Serial Number: 80114640004; Geometry.Height: 0.4mm; Tolerance: +/-5%; PCB DECAL: SR0402
R5 R7 = RES-10K-0402: RES FILM;10K;+/-5%;1/16W;0402;0.4mm;ROHS; Manufacture 1 P/N: RC0402JR-0710KL;WR04X103_JTL; Manufacture 1: YAGEO;Walsin; Serial Number: 80114640004; Geometry.Height: 0.4mm; Tolerance: +/-5%; PCB DECAL: SR0402
R6 R8 = RES-100K-0402: as R28 on sheet POWER; Tolerance: +/-5%; PCB DECAL: SR0402
S5 S6 = IT-1157P: Geometry.Height: 3.1 mm; PCB DECAL: IT-1157P
TVS12 = ESD-TVS-PESDU4581P1H: as TVS11 on sheet POWER; Manufacture 1 P/N: PESDU4581P1H; PCB DECAL: DFN1006

## Sheet AUDIO_1.SchDoc: Air724UG 参考设计
size 594 x 419 mm; DESIGNER: Loukanghua; REV: V1.0
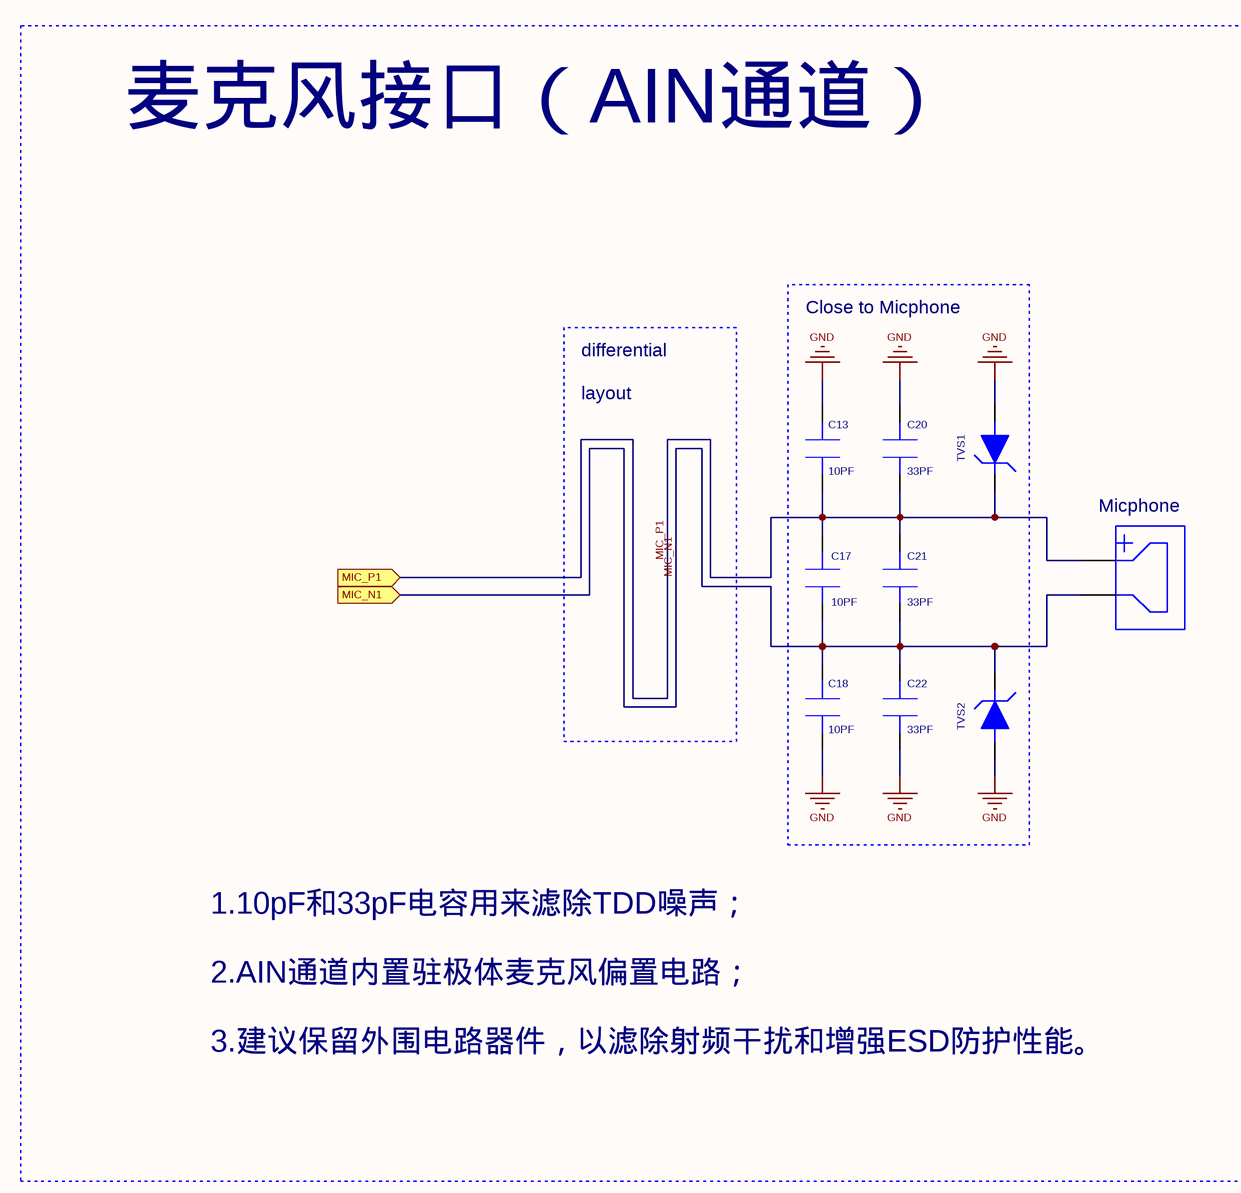
[diagram p17: AUDIO_1.SchDoc, top left]
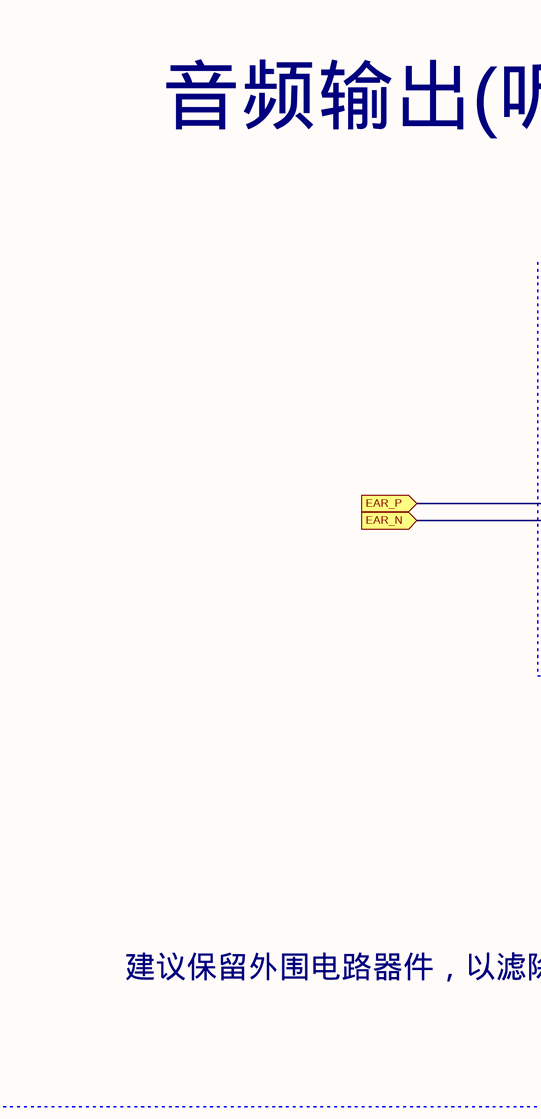
[diagram p18: AUDIO_1.SchDoc, top middle]
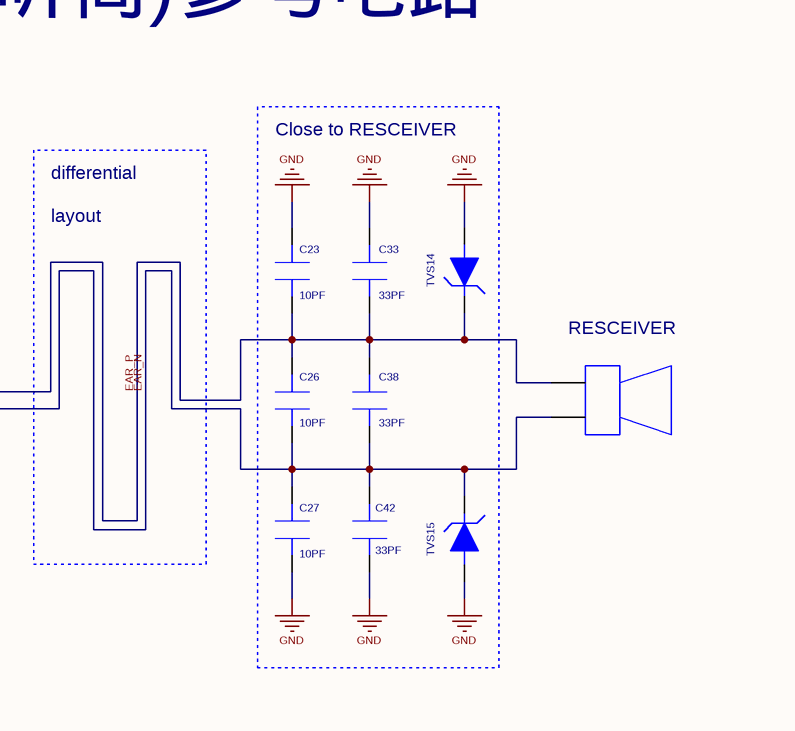
[diagram p19: AUDIO_1.SchDoc, top right]
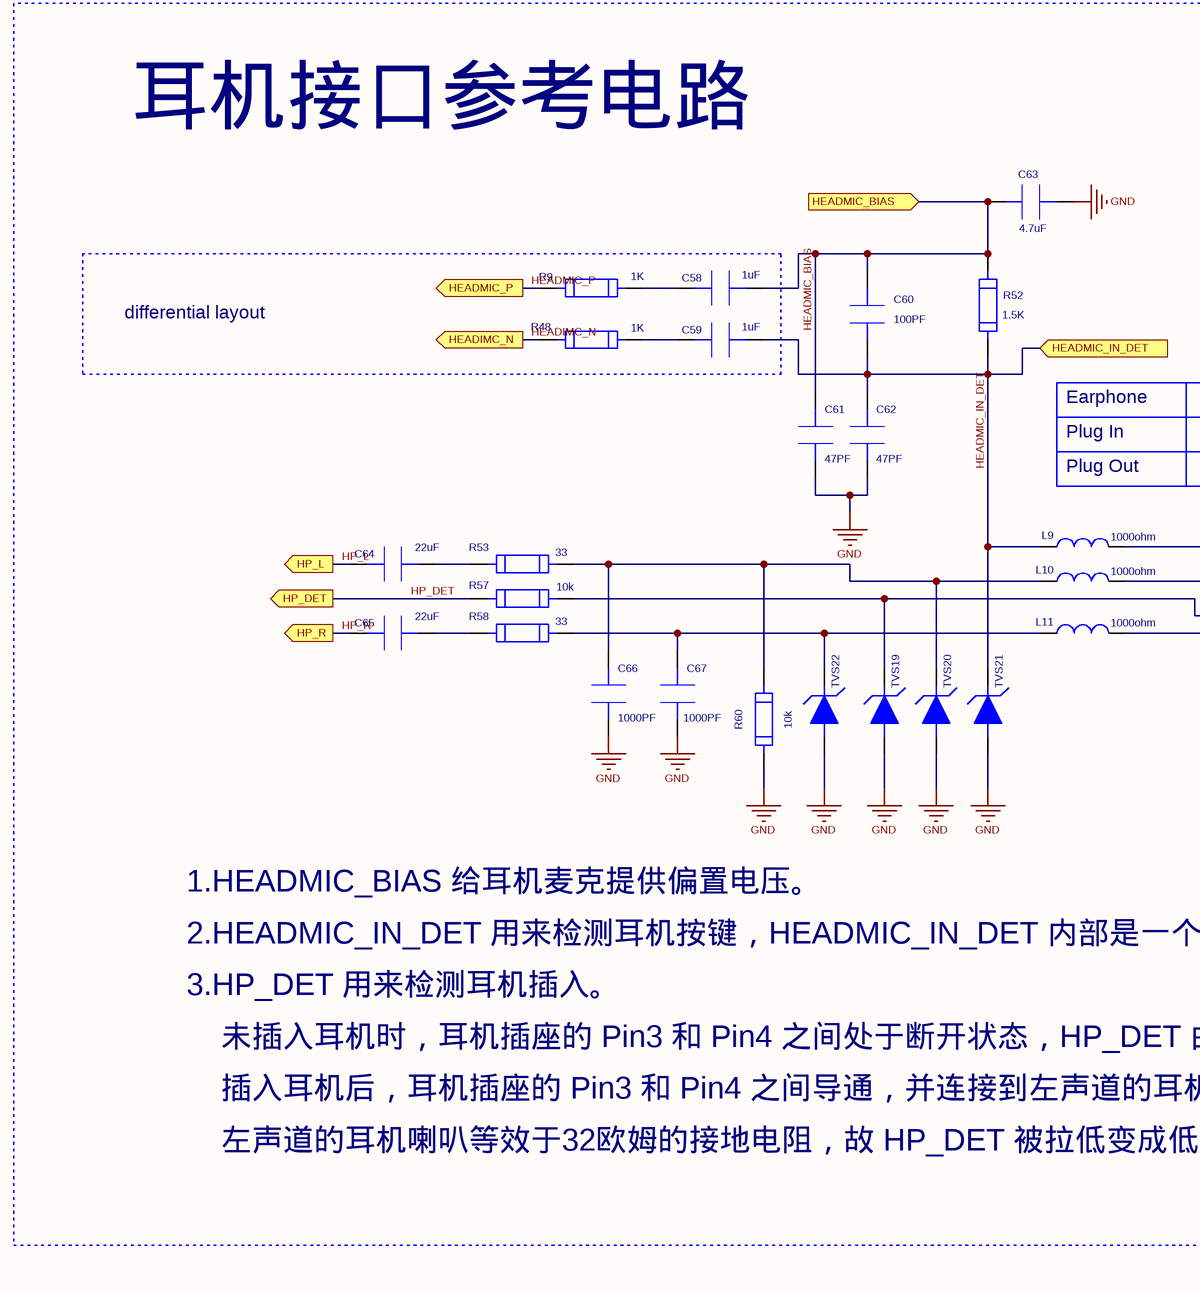
[diagram p20: AUDIO_1.SchDoc, bottom left]
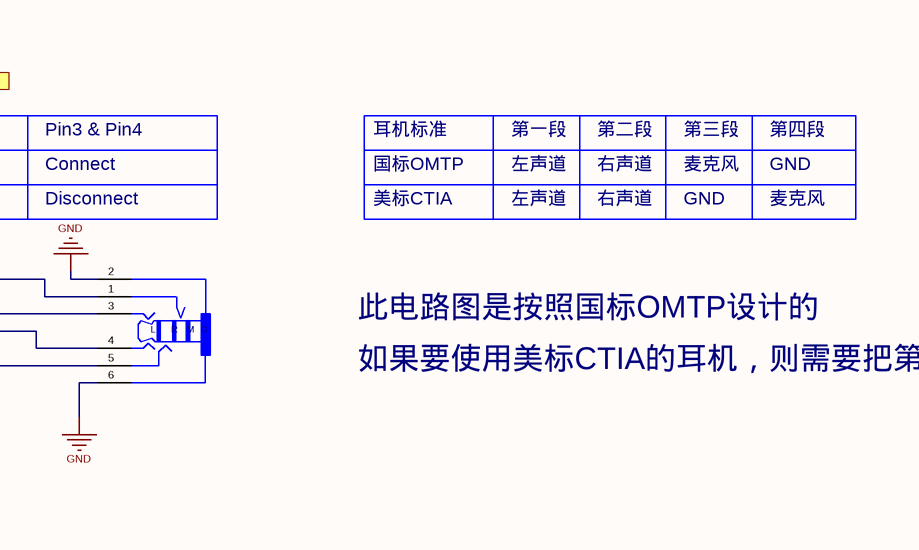
[diagram p21: AUDIO_1.SchDoc, bottom middle]
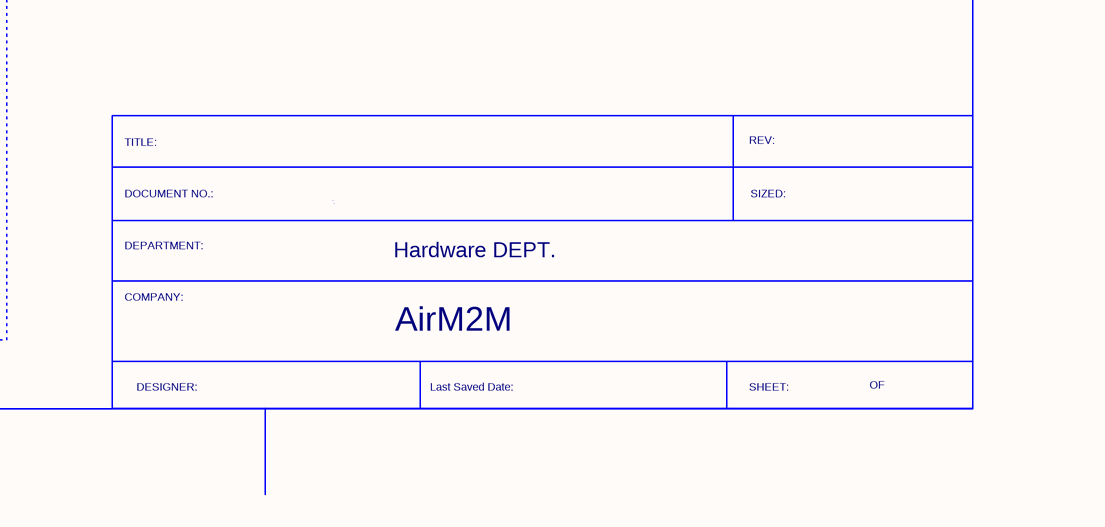
[diagram p22: AUDIO_1.SchDoc, bottom right]

### Parts
C13  value 10PF  [SC0201]  (hidden comment: CAP-10PF-0201-COG)
C17  value 10PF  [SC0201]  (hidden comment: CAP-10PF-0201-COG)
C18  value 10PF  [SC0201]  (hidden comment: CAP-10PF-0201-COG)
C20  value 33PF  [SC0201]  (hidden comment: CAP-10PF-0201-COG)
C21  value 33PF  [SC0201]  (hidden comment: CAP-10PF-0201-COG)
C22  value 33PF  [SC0201]  (hidden comment: CAP-10PF-0201-COG)
C23  value 10PF  [SC0201]  (hidden comment: CAP-10PF-0201-COG)
C26  value 10PF  [SC0201]  (hidden comment: CAP-10PF-0201-COG)
C27  value 10PF  [SC0201]  (hidden comment: CAP-10PF-0201-COG)
C33  value 33PF  [SC0201]  (hidden comment: CAP-10PF-0201-COG)
C38  value 33PF  [SC0201]  (hidden comment: CAP-10PF-0201-COG)
C42  value 33PF  [SC0201]  (hidden comment: CAP-10PF-0201-COG)
C58  value 1uF  [SC0402]  (hidden comment: CAP-1UF-0402-X5R)
C59  value 1uF  [SC0402]  (hidden comment: CAP-1UF-0402-X5R)
C60  value 100PF  [SC0402]  (hidden comment: CAP-100PF-0402-C0G)
C61  value 47PF  [SC0402]  (hidden comment: CAP-47PF-0402-C0G)
C62  value 47PF  [SC0402]  (hidden comment: CAP-47PF-0402-C0G)
C63  value 4.7uF  [SC0402]  (hidden comment: CAP-4.7UF-6.3V-0402)
C64  value 22uF  [SC0402]  (hidden comment: CAP-10UF-6.3V-0402)
C65  value 22uF  [SC0402]  (hidden comment: CAP-10UF-6.3V-0402)
C66  value 1000PF  [SC0402]  (hidden comment: CAP-1000PF-0402-X7R)
C67  value 1000PF  [SC0402]  (hidden comment: CAP-1000PF-0402-X7R)
J3  AUDIO-SUGGEST-1  [AUDIO-EAR-DA0635180-1208-A]  (value not drawn)
J5  AUDIO-SPEAKER-BLUEHY  [CON2-2]  (value not drawn)
L9  value 1000ohm  [SL0402]  (hidden comment: BEAD-1000OHM-0402)
L10  value 1000ohm  [SL0402]  (hidden comment: BEAD-1000OHM-0402)
L11  value 1000ohm  [SL0402]  (hidden comment: BEAD-1000OHM-0402)
M1  AUDIO-MIC-BLUEHY  [CON2-2/3]  (value not drawn)
R9  value 1K  [SR0402]  (hidden comment: RES-1K-0402)
R48  value 1K  [SR0402]  (hidden comment: RES-1K-+-1%-0402)
R52  value 1.5K  [SR0402]  (hidden comment: RES-1.2K-0402)
R53  value 33  [SR0402]  (hidden comment: RES-33-0402)
R57  value 10k  [SR0402]  (hidden comment: RES-10K-0402)
R58  value 33  [SR0402]  (hidden comment: RES-33-0402)
R60  value 10k  [SR0402]  (hidden comment: RES-10K-0402)
TVS1  ESD-TVS-ESD9X5.0ST5G  [SOD-923-ESD9X5.0ST5G]  (value not drawn)
TVS2  ESD-TVS-ESD9X5.0ST5G  [SOD-923-ESD9X5.0ST5G]  (value not drawn)
TVS14  ESD-TVS-ESD9X5.0ST5G  [SOD-923-ESD9X5.0ST5G]  (value not drawn)
TVS15  ESD-TVS-ESD9X5.0ST5G  [SOD-923-ESD9X5.0ST5G]  (value not drawn)
TVS19  ESD-TVS-ESD5Z5.0T1_A  [SOD523(ESD5Z5.0T1)]  (value not drawn)
TVS20  ESD-TVS-ESD5Z5.0T1_A  [SOD523(ESD5Z5.0T1)]  (value not drawn)
TVS21  ESD-TVS-ESD5Z5.0T1_A  [SOD523(ESD5Z5.0T1)]  (value not drawn)
TVS22  ESD-TVS-ESD5Z5.0T1_A  [SOD523(ESD5Z5.0T1)]  (value not drawn)

### Blocks framed on the sheet
麦克风接口（AIN通道）: M1
音频输出(听筒)参考电路: J5
Close to Micphone: C13 C17 C18 C20-C22 TVS1 TVS2
Close to RESCEIVER: C23 C26 C27 C33 C38 C42 TVS14 TVS15
耳机接口参考电路: C60-C67 J3 L9-L11 R52 R53 R57 R58 R60 TVS19-TVS22
differential layout: C58 C59 R9 R48

### Ports
EAR_N, EAR_P, HEADIMC_N (out), HEADMIC_BIAS, HEADMIC_IN_DET, HEADMIC_P (out), HP_DET (out), HP_L (out), HP_R (out), MIC_N1, MIC_P1

### Nets
GND: C13.1 C18.2 C20.1 C22.2 C23.1 C27.2 C33.1 C42.2 C61.2 C62.2 C63.2 C66.2 C67.2 J3.2 J3.6 R60.1 TVS1.2 TVS2.2 TVS14.2 TVS15.2 TVS19.2 TVS20.2 TVS21.2 TVS22.2
EAR_N: C26.2 C27.1 C38.2 C42.1 J5.2 TVS15.1 ; port EAR_N
EAR_P: C23.2 C26.1 C33.2 C38.1 J5.1 TVS14.1 ; port EAR_P
HEADIMC_N: R48.1 ; port HEADIMC_N
HEADMIC_BIAS: C58.2 C60.1 C61.1 C63.1 R52.2 ; port HEADMIC_BIAS
HEADMIC_IN_DET: C59.2 C60.2 C62.1 L9.1 R52.1 TVS21.1 ; port HEADMIC_IN_DET
HEADMIC_P: R9.1 ; port HEADMIC_P
HP_DET: R57.1 ; port HP_DET
HP_L: C64.1 ; port HP_L
HP_R: C65.1 ; port HP_R
MIC_N1: C17.2 C18.1 C21.2 C22.1 M1.2 TVS2.1 ; port MIC_N1
MIC_P1: C13.2 C17.1 C20.2 C21.1 M1.1 TVS1.1 ; port MIC_P1
NetC58_1: C58.1 R9.2
NetC59_1: C59.1 R48.2
NetC64_2: C64.2 R53.1
NetC65_2: C65.2 R58.1
NetC66_1: C66.1 L10.1 R53.2 R60.2 TVS20.1
NetC67_1: C67.1 L11.1 R58.2 TVS22.1
NetJ3_1: J3.1 L9.2
NetJ3_3: J3.3 L10.2
NetJ3_4: J3.4 R57.2 TVS19.1
NetJ3_5: J3.5 L11.2

### Notes on the sheet
- differential
- layout
- (near M1) Micphone
- (near J5) RESCEIVER
- 1.10pF和33pF电容用来滤除TDD噪声；
- 2.AIN通道内置驻极体麦克风偏置电路；
- 3.建议保留外围电路器件，以滤除射频干扰和增强ESD防护性能。
- 建议保留外围电路器件，以滤除射频干扰和增强ESD防护性能。
- Earphone
- Pin3 & Pin4
- 耳机标准
- 第一段
- 第二段
- 第三段
- 第四段
- Plug In
- Plug Out
- Connect
- Disconnect
- 国标OMTP
- 美标CTIA
- 左声道
- 右声道
- 麦克风
- GND
- 此电路图是按照国标OMTP设计的
- 如果要使用美标CTIA的耳机，则需要把第3段、第4段的接线对换一下。
- 1.HEADMIC_BIAS 给耳机麦克提供偏置电压。
- 2.HEADMIC_IN_DET 用来检测耳机按键，HEADMIC_IN_DET 内部是一个ADC，故 HEADMIC_IN_DET 还可以支持多功能按键。
- 3.HP_DET 用来检测耳机插入。
- 未插入耳机时，耳机插座的 Pin3 和 Pin4 之间处于断开状态，HP_DET 由内部拉高，为高电平。
- TITLE:
- REV:
- 插入耳机后，耳机插座的 Pin3 和 Pin4 之间导通，并连接到左声道的耳机喇叭。
- 左声道的耳机喇叭等效于32欧姆的接地电阻，故 HP_DET 被拉低变成低电平。
- DEPARTMENT:
- DOCUMENT NO.:
- Hardware DEPT.
- SIZED:
- COMPANY:
- AirM2M
- DESIGNER:
- Last Saved Date:
- SHEET:
- OF
- (in symbol AUDIO-SUGGEST-1) L; R; M; G

### Library data of the parts
C13 C17 C18 C20-C23 C26 C27 C33 C38 C42 = CAP-10PF-0201-COG: CAP CER C0G;10PF;+/-5%;25V;0201;0.35mm;ROHS; Manufacture 1: Eyang;; Manufacture 1 P/N: C0201C0G100J250NT; Serial Number: 80212640006; Geometry.Height: 0.35mm; Tolerance: +/-5%; PCB DECAL: SC0201
C58 C59 = CAP-1UF-0402-X5R: as C74 on sheet MODULE; Tolerance: +/-10%; PCB DECAL: SC0402
C60 = CAP-100PF-0402-C0G: CAP CER C0G;100PF;+/-5%;50V;0402;0.5mm;ROHS; Manufacture 1: MURATA;TDK;Yageo;Walsin;Eyang; Manufacture 1 P/N: GRM1555C1H101J****;C1005C0G1H101J;CC0402JRNP09BN101;0402N101J500CT;C0402C0G101J500N*; Geometry.Height: 0.55mm; Serial Number: 80214650002; Tolerance: +/-5%; PCB DECAL: SC0402
C61 C62 = CAP-47PF-0402-C0G: CAP CER C0G;47PF;+/-5%;50V;0402;0.5mm;ROHS; Manufacture 1: Murata;Yageo;Walsin;Eyang; Manufacture 1 P/N: GRM1555C1H470J****;CC0402JRNPO9BN470;0402N470J500CT;C0402C0G470J500N*; Geometry.Height: 0.55mm; Serial Number: 80214650005; Tolerance: +/-5%; PCB DECAL: SC0402
C63 = CAP-4.7UF-6.3V-0402: CAP CER;4.7uF;20%;6.3V;0402; Manufacture 1: MURATA; Manufacture 1 P/N: GRM155R60J475ME47D; Priority: 1; Geometry.Height: 0.60mm; Serial Number: 31201001402; Tolerance: +/-20%; Update Time: 2014-11-11; PCB DECAL: SC0402
C64 C65 = CAP-10UF-6.3V-0402: CAP CER;10uF;20%;6.3V; Manufacture 1: MURATA; Manufacture 1 P/N: GRM155R60J106ME11D; Priority: 1; Geometry.Height: 0.70mm; Serial Number: 31201001523; Tolerance: +/-20%; DataSheet: Z:\DATASHEET\CAP\MURATA_GRM155R60J106ME11D.PDF; Update Time: 2016-06-29; PCB DECAL: SC0402
C66 C67 = CAP-1000PF-0402-X7R: as C83 on sheet ADC_RESET; Tolerance: +/-10%; PCB DECAL: SC0402
J3 = AUDIO-SUGGEST-1: 耳机座; PCB DECAL: AUDIO-EAR-DA0635180-1208-A
L9-L11 = BEAD-1000OHM-0402: Bead;1000ohm;250mA;0402;0.6mm;ROHS; Manufacture 1: Murata;Taiyo Yuden;Chilisin(奇力新)();; Manufacture 1 P/N: BLM15HD102SN1;BK1005HS102-T;SBJ100505T-102Y-N; Geometry.Height: 0.65mm; Serial Number: 80334000002; PCB DECAL: SL0402
R9 = RES-1K-0402: RES FILM;1K;+/-5%;1/16W;0402;0.4mm;ROHS; Manufacture 1: YAGEO;Walsin; Manufacture 1 P/N: RC0402JR-071KL;WR04X102_JTL; Geometry.Height: 0.40mm; Serial Number: 80114640003; Tolerance: +/-5%; PCB DECAL: SR0402
R48 = RES-1K-+-1%-0402: RES FILM;1K;+/-1%;1/16W;0402;0.4mm;ROHS; Manufacture 1: YAGEO; Manufacture 1 P/N: RC0402FR-071KL; Serial Number: 80114440035; Geometry.Height: 0.4mm; Tolerance: +/-1%; PCB DECAL: SR0402
R52 = RES-1.2K-0402: RES FILM;1.2k;+/-5%;1/16W;0402;0.4mm;ROHS; Manufacture 1: YAGEO; Manufacture 1 P/N: RC0402JR-071K2L; Geometry.Height: 0.40mm; Serial Number: 80114640057; Tolerance: 5%; PCB DECAL: SR0402
R53 R58 = RES-33-0402: RES FILM;33;+/-5%;1/16W;0402;0.4mm;ROHS; Manufacture 1 P/N: RC0402JR-0733RL; Manufacture 1: YAGEO; Serial Number: 80114640011; Geometry.Height: 0.4mm; Tolerance: +/-5%; PCB DECAL: SR0402
R57 R60 = RES-10K-0402: as R5 on sheet ADC_RESET; Geometry.Height: 0.4mm; Tolerance: +/-5%; PCB DECAL: SR0402
TVS1 TVS2 TVS14 TVS15 = ESD-TVS-ESD9X5.0ST5G: TVS;5.0V;65PF;SOD?923;ROHS; Manufacture 1: ONSEMI; Geometry.Height: 0.43mm; Serial Number: 81121000001; Manufacture 1 P/N: ESD9X5.0ST5G; PCB DECAL: SOD-923-ESD9X5.0ST5G
TVS19-TVS22 = ESD-TVS-ESD5Z5.0T1_A: TVS;5V;80pF;SOD-523;ROHS; Manufacture 1 P/N: ESD5Z5V-2/TR;PESD5Z5.0;UM5055; Manufacture 1: Will(韦尔);Nxp;Union;; Geometry.Height: 0.7mm; Serial Number: 81100000002; PCB DECAL: SOD523(ESD5Z5.0T1)
J5 = AUDIO-SPEAKER-BLUEHY: PCB DECAL: CON2-2
M1 = AUDIO-MIC-BLUEHY: PCB DECAL: CON2-2/3